# EAGLE design controller_rev4.3_flat (EAGLE 9.6.2)

## Sheet 1 of 3: Controller
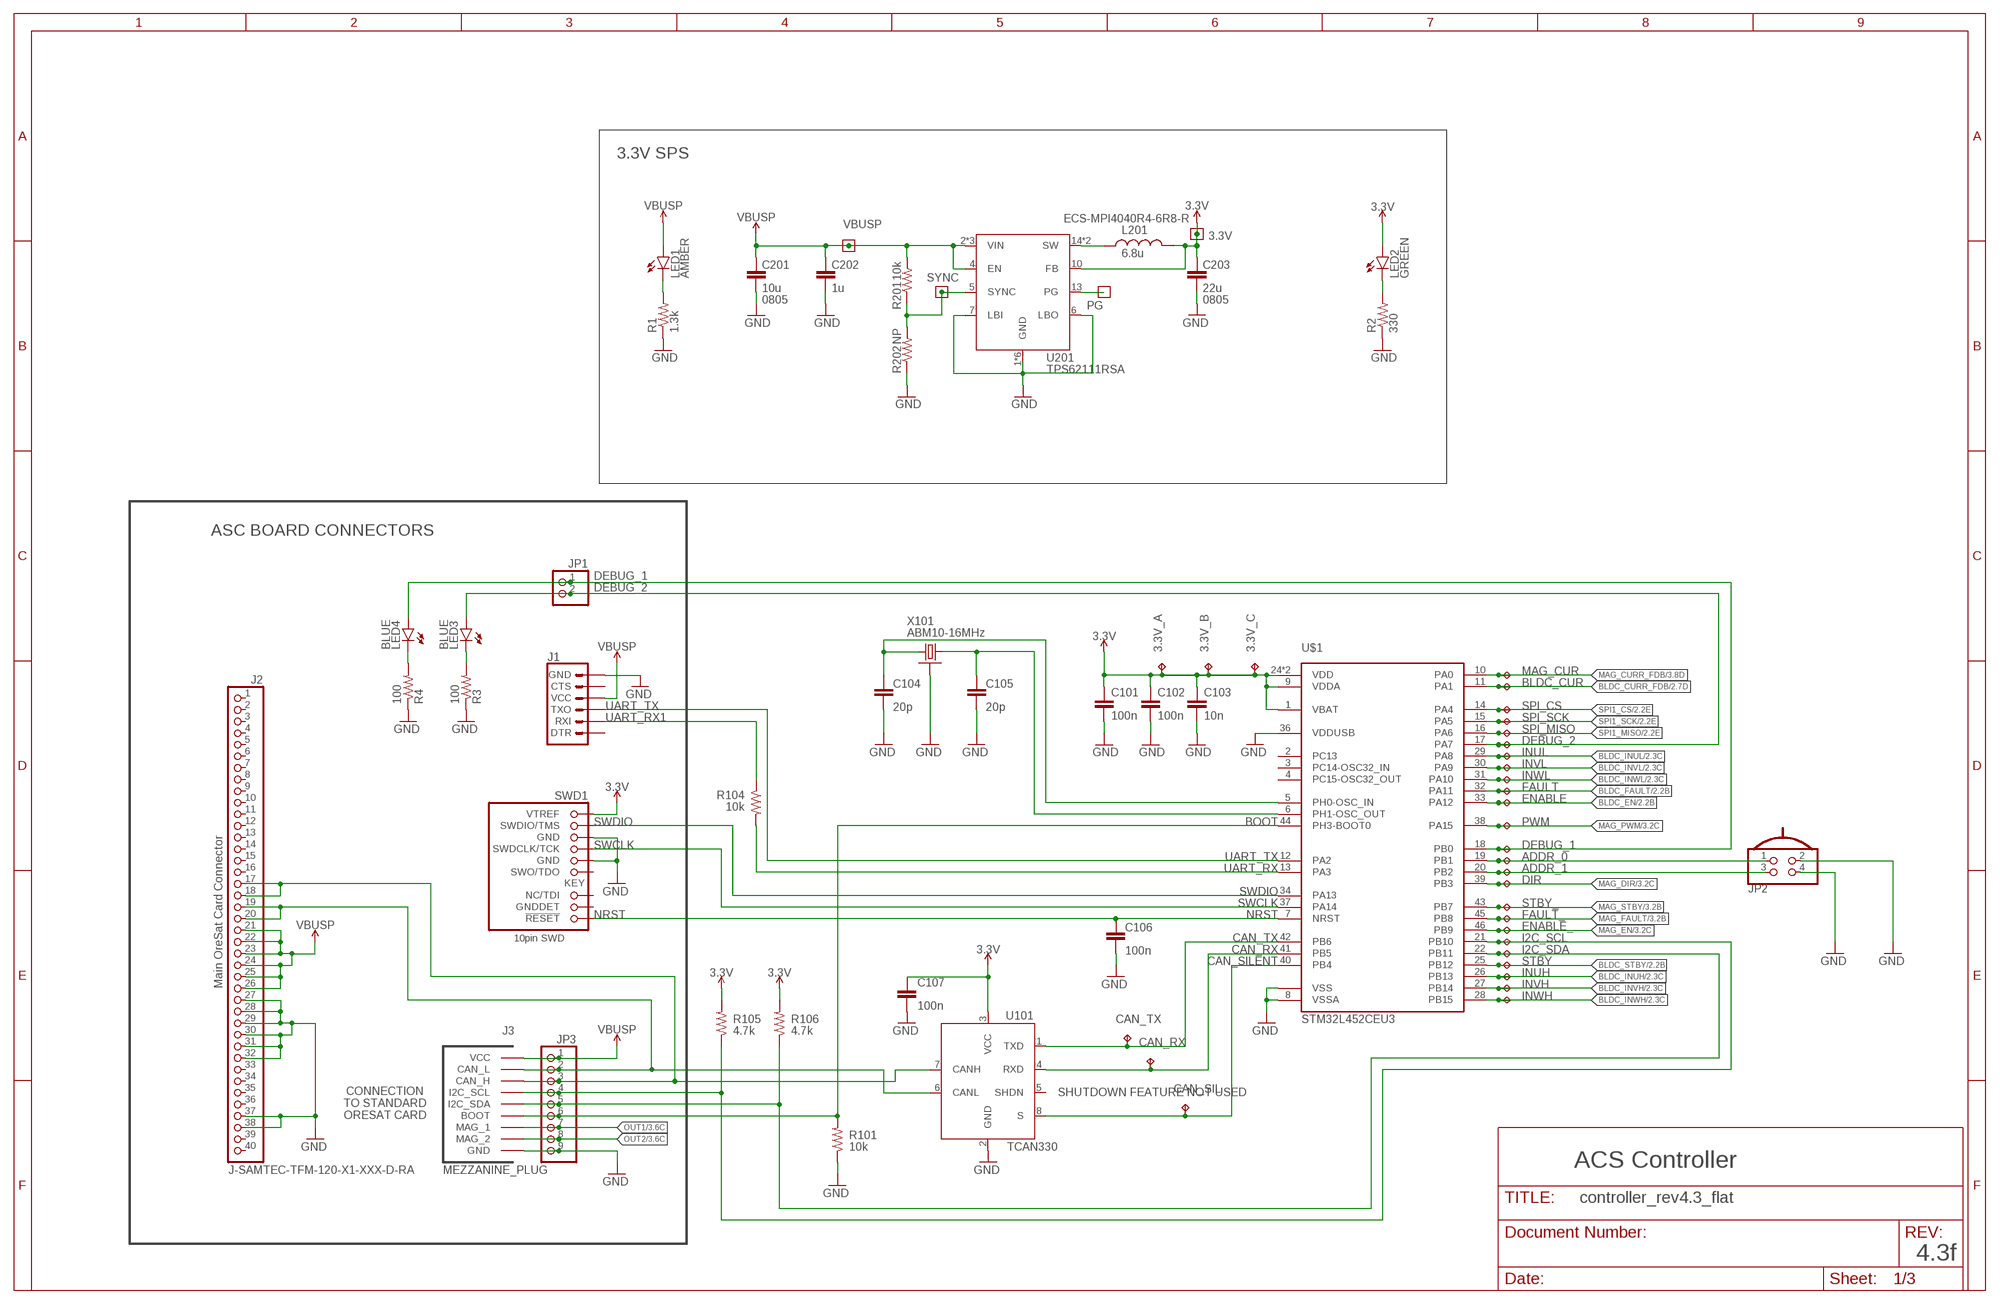
[diagram p0: schematic, sheet 1]

### Parts
3.3V  TEST-POINT-LARGE-SQUARE  [1X01]
3.3V_A  TEST-POINT-LARGE  [1X01]
3.3V_B  TEST-POINT-LARGE  [1X01]
3.3V_C  TEST-POINT-LARGE  [1X01]
ADDR_0  TEST-POINT-LARGE  [1X01]
ADDR_1  TEST-POINT-LARGE  [1X01]
BLDC_CUR  TEST-POINT-LARGE  [1X01]
C101  100n  C-EU0402-B-NOSILK  [.0402-B-NOSILK]
C102  100n  C-EU0402-B-NOSILK  [.0402-B-NOSILK]
C103  10n  C-EU0402-B-NOSILK  [.0402-B-NOSILK]
C104  20p  C-EU0402-B-NOSILK  [.0402-B-NOSILK]
C105  20p  C-EU0402-B-NOSILK  [.0402-B-NOSILK]
C106  100n  C-EU0402-B-NOSILK  [.0402-B-NOSILK]
C107  100n  C-EU0402-B-NOSILK  [.0402-B-NOSILK]
C201  10u  C-EU0805-B-NOSILK  [.0805-B-NOSILK]
C202  1u  C-EU0603-C-NOSILK  [.0603-C-NOSILK]
C203  22u  C-EU0805-B-NOSILK  [.0805-B-NOSILK]
CAN_RX  TEST-POINT-LARGE  [1X01]
CAN_SIL  TEST-POINT-LARGE  [1X01]
CAN_TX  TEST-POINT-LARGE  [1X01]
DEBUG_1  TEST-POINT-LARGE  [1X01]
DEBUG_2  TEST-POINT-LARGE  [1X01]
DIR  TEST-POINT-LARGE  [1X01]
ENABLE  TEST-POINT-LARGE  [1X01]
ENABLE_  TEST-POINT-LARGE  [1X01]
FAULT  TEST-POINT-LARGE  [1X01]
FAULT_  TEST-POINT-LARGE  [1X01]
I2C_SCL  TEST-POINT-LARGE  [1X01]
I2C_SDA  TEST-POINT-LARGE  [1X01]
INUH  TEST-POINT-LARGE  [1X01]
INUL  TEST-POINT-LARGE  [1X01]
INVH  TEST-POINT-LARGE  [1X01]
INVL  TEST-POINT-LARGE  [1X01]
INWH  TEST-POINT-LARGE  [1X01]
INWL  TEST-POINT-LARGE  [1X01]
J1  6_PIN_SERIAL_TARGETSILK  [6_PIN_SERIAL_TARGET_SIDE_W_SILK]
J2  J-SAMTEC-TFM-120-X1-XXX-D-RA  [J-SAMTEC-TFM-120-X1-XXX-D-RA]
J3  MEZZANINE_PLUG  [MEZZANINE_PLUG]
JP1  PINHD-1X2  [1X02]
JP2  PINHD-2X2  [2X02]
JP3  PINHD-1X9  [1X09]
L201  6.8u  L-ECS-MPI4040  [ECS-MPI4040]
LED1  AMBER  LEDCHIPLED_0603  [CHIPLED_0603]
LED2  GREEN  LEDCHIPLED_0603  [CHIPLED_0603]
LED3  BLUE  LEDCHIPLED_0603  [CHIPLED_0603]
LED4  BLUE  LEDCHIPLED_0603  [CHIPLED_0603]
MAG_CUR  TEST-POINT-LARGE  [1X01]
PG  TEST-POINT-LARGE-SQUARE  [1X01]
PWM  TEST-POINT-LARGE  [1X01]
R1  1.3k  R-US_0402-B-NOSILK  [.0402-B-NOSILK]
R2  330  R-US_0402-B-NOSILK  [.0402-B-NOSILK]
R3  100  R-US_0402-B-NOSILK  [.0402-B-NOSILK]
R4  100  R-US_0402-B-NOSILK  [.0402-B-NOSILK]
R101  10k  R-US_0402-B-NOSILK  [.0402-B-NOSILK]
R104  10k  R-US_0402-B-NOSILK  [.0402-B-NOSILK]
R105  4.7k  R-US_0402-B-NOSILK  [.0402-B-NOSILK]
R106  4.7k  R-US_0402-B-NOSILK  [.0402-B-NOSILK]
R201  10k  R-US_0603-C-NOSILK  [.0603-C-NOSILK]
R202  NP  R-US_0603-C-NOSILK  [.0603-C-NOSILK]
SPI_CS  TEST-POINT-LARGE  [1X01]
SPI_MISO  TEST-POINT-LARGE  [1X01]
SPI_SCK  TEST-POINT-LARGE  [1X01]
STBY  TEST-POINT-LARGE  [1X01]
STBY_  TEST-POINT-LARGE  [1X01]
SWD1  1.27MM-SWD-CONNECTOR  [1.27MM_2X5]
SYNC  TEST-POINT-LARGE-SQUARE  [1X01]
U101  TCAN330  [SOT23-8_TI-DCN]
U201  TPS62111RSA  TPS6211X  [S-PVQFN-16]
U$1  STM32L452CEU3  [QFPN-48]
VBUSP  TEST-POINT-LARGE-SQUARE  [1X01]
X101  ABM10-16MHz  CRYSTAL-WITH-GND  [CRYSTAL_2.5X2]

### Nets
3.3V: 3.3V.1 3.3V_A.1(TP) 3.3V_B.1(TP) 3.3V_C.1(TP) C101.1 C102.1 C103.1 C107.1 C203.1 L201.2 LED2.A R105.2 R106.2 SWD1.VTREF U101.3(VCC) U201.10(FB) U$1.1(VBAT) U$1.9(VDDA) U$1.24(VDD) U$1.48(VDD) ; also sheet 2,3
ADDR_0: ADDR_0.1(TP) JP2.1 U$1.19(PB1)
ADDR_1: ADDR_1.1(TP) JP2.3 U$1.20(PB2)
BLDC_CURR_FDB: BLDC_CUR.1(TP) U$1.11(PA1) ; also sheet 2
BLDC_EN: ENABLE.1(TP) U$1.33(PA12) ; also sheet 2
BLDC_FAULT: FAULT.1(TP) U$1.32(PA11) ; also sheet 2
BLDC_INUH: INUH.1(TP) U$1.26(PB13) ; also sheet 2
BLDC_INUL: INUL.1(TP) U$1.29(PA8) ; also sheet 2
BLDC_INVH: INVH.1(TP) U$1.27(PB14) ; also sheet 2
BLDC_INVL: INVL.1(TP) U$1.30(PA9) ; also sheet 2
BLDC_INWH: INWH.1(TP) U$1.28(PB15) ; also sheet 2
BLDC_INWL: INWL.1(TP) U$1.31(PA10) ; also sheet 2
BLDC_STBY: STBY.1(TP) U$1.25(PB12) ; also sheet 2
BOOT: J3.P$9(BOOT) J3.P$22(BOOT) JP3.6 R101.2 U$1.44(PH3-BOOT0)
CAN_H: J2.17 J2.18 J3.P$6(CAN_H) J3.P$25(CAN_H) JP3.3 U101.7(CANH)
CAN_L: J2.19 J2.20 J3.P$5(CAN_L) J3.P$26(CAN_L) JP3.2 U101.6(CANL)
CAN_RX: CAN_RX.1(TP) U101.4(RXD) U$1.41(PB5)
CAN_SILENT: CAN_SIL.1(TP) U101.8(S) U$1.40(PB4)
CAN_TX: CAN_TX.1(TP) U101.1(TXD) U$1.42(PB6)
CLK1: C104.1 U$1.5(PH0-OSC_IN) X101.3
CLK2: C105.1 U$1.6(PH1-OSC_OUT) X101.1
DEBUG_1: DEBUG_1.1(TP) JP1.1 LED4.A U$1.18(PB0)
DEBUG_2: DEBUG_2.1(TP) JP1.2 LED3.A U$1.17(PA7)
GND: C101.2 C102.2 C103.2 C104.2 C105.2 C106.2 C107.2 C201.2 C202.2 C203.2 J1.P$6(GND) J2.27 J2.28 J2.29 J2.30 J2.31 J2.32 J2.37 J2.38 J3.P$1(GND) J3.P$2(GND) J3.P$14(GND) J3.P$15(GND) J3.P$16(GND) J3.P$17(GND) J3.P$29(GND) J3.P$30(GND) JP2.2 JP2.4 JP3.9 R1.1 R2.1 R3.1 R4.1 R101.1 R202.1 SWD1.GND SWD1.GND@2(GND) U101.2(GND) U201.1(GND) U201.6(LBO) U201.7(LBI) U201.9(GND) U201.11(GND) U201.12(GND) U201.16(GND) U201.PAD(GND) U$1.8(VSSA) U$1.23(VSS) U$1.35(VSS) U$1.36(VDDUSB) U$1.47(VSS) U$1.EPAD(VSS) X101.2(SHIELD) X101.4(SHIELD) ; also sheet 2,3
I2C_SCL: I2C_SCL.1(TP) J3.P$7(I2C_SCL) J3.P$24(I2C_SCL) JP3.4 R105.1 U$1.21(PB10)
I2C_SDA: I2C_SDA.1(TP) J3.P$8(I2C_SDA) J3.P$23(I2C_SDA) JP3.5 R106.1 U$1.22(PB11)
MAG_CURR_FDB: MAG_CUR.1(TP) U$1.10(PA0) ; also sheet 3
MAG_DIR: DIR.1(TP) U$1.39(PB3) ; also sheet 3
MAG_EN: ENABLE_.1(TP) U$1.46(PB9) ; also sheet 3
MAG_FAULT: FAULT_.1(TP) U$1.45(PB8) ; also sheet 3
MAG_PWM: PWM.1(TP) U$1.38(PA15) ; also sheet 3
MAG_STBY: STBY_.1(TP) U$1.43(PB7) ; also sheet 3
N$5: LED4.C R4.2
N$6: LED3.C R3.2
N$7: LED1.C R1.2
N$8: LED2.C R2.2
NRST: C106.1 SWD1.!RESET U$1.7(NRST)
OUT1: J3.P$10(MAG_1) J3.P$21(MAG_1) JP3.7 ; also sheet 3
OUT2: J3.P$11(MAG_2) J3.P$20(MAG_2) JP3.8 ; also sheet 3
SPI1_CS: SPI_CS.1(TP) U$1.14(PA4) ; also sheet 2
SPI1_MISO: SPI_MISO.1(TP) U$1.16(PA6) ; also sheet 2
SPI1_SCK: SPI_SCK.1(TP) U$1.15(PA5) ; also sheet 2
SWCLK: SWD1.SWDCLK(SWDCLK/TCK) U$1.37(PA14)
SWDIO: SWD1.SWDIO(SWDIO/TMS) U$1.34(PA13)
TPS62111-PG2: PG.1 U201.13(PG)
TPS62111-SYNC2: R201.1 R202.2 SYNC.1 U201.5(SYNC)
TPS62111_SW1: L201.1 U201.14(SW) U201.15(SW)
UART_RX: R104.2 U$1.13(PA3)
UART_RX1: J1.P$3(RXI) R104.1
UART_TX: J1.P$2(TXO) U$1.12(PA2)
VBUSP: C201.1 C202.1 J1.P$4(VCC) J2.21 J2.22 J2.23 J2.24 J2.25 J2.26 J3.P$3(VCC) J3.P$4(VCC) J3.P$12(VCC) J3.P$13(VCC) J3.P$18(VCC) J3.P$19(VCC) J3.P$27(VCC) J3.P$28(VCC) JP3.1 LED1.A R201.2 U201.2(VIN) U201.3(VIN) U201.4(EN) U201.8(VIN) VBUSP.1 ; also sheet 2,3
Unconnected: J1.P$1(DTR) J1.P$5(CTS) J2.1 J2.2 J2.3 J2.4 J2.5 J2.6 J2.7 J2.8 J2.9 J2.10 J2.11 J2.12 J2.13 J2.14 J2.15 J2.16 J2.33 J2.34 J2.35 J2.36 J2.39 J2.40 SWD1.GNDDET SWD1.NC(NC/TDI) SWD1.SWO(SWO/TDO) U101.5(SHDN) U$1.2(PC13) U$1.3(PC14-OSC32_IN) U$1.4(PC15-OSC32_OUT)

### Notes on the sheet
- 3.3V SPS
- ECS-MPI4040R4-6R8-R
- 0805 | 0805
- ASC BOARD CONNECTORS
- Main OreSat Card Connector
- CONNECTION 
  TO STANDARD
  ORESAT CARD
- SHUTDOWN FEATURE NOT USED
- ACS Controller
- 4.3f

## Sheet 2 of 3: Reaction Wheel
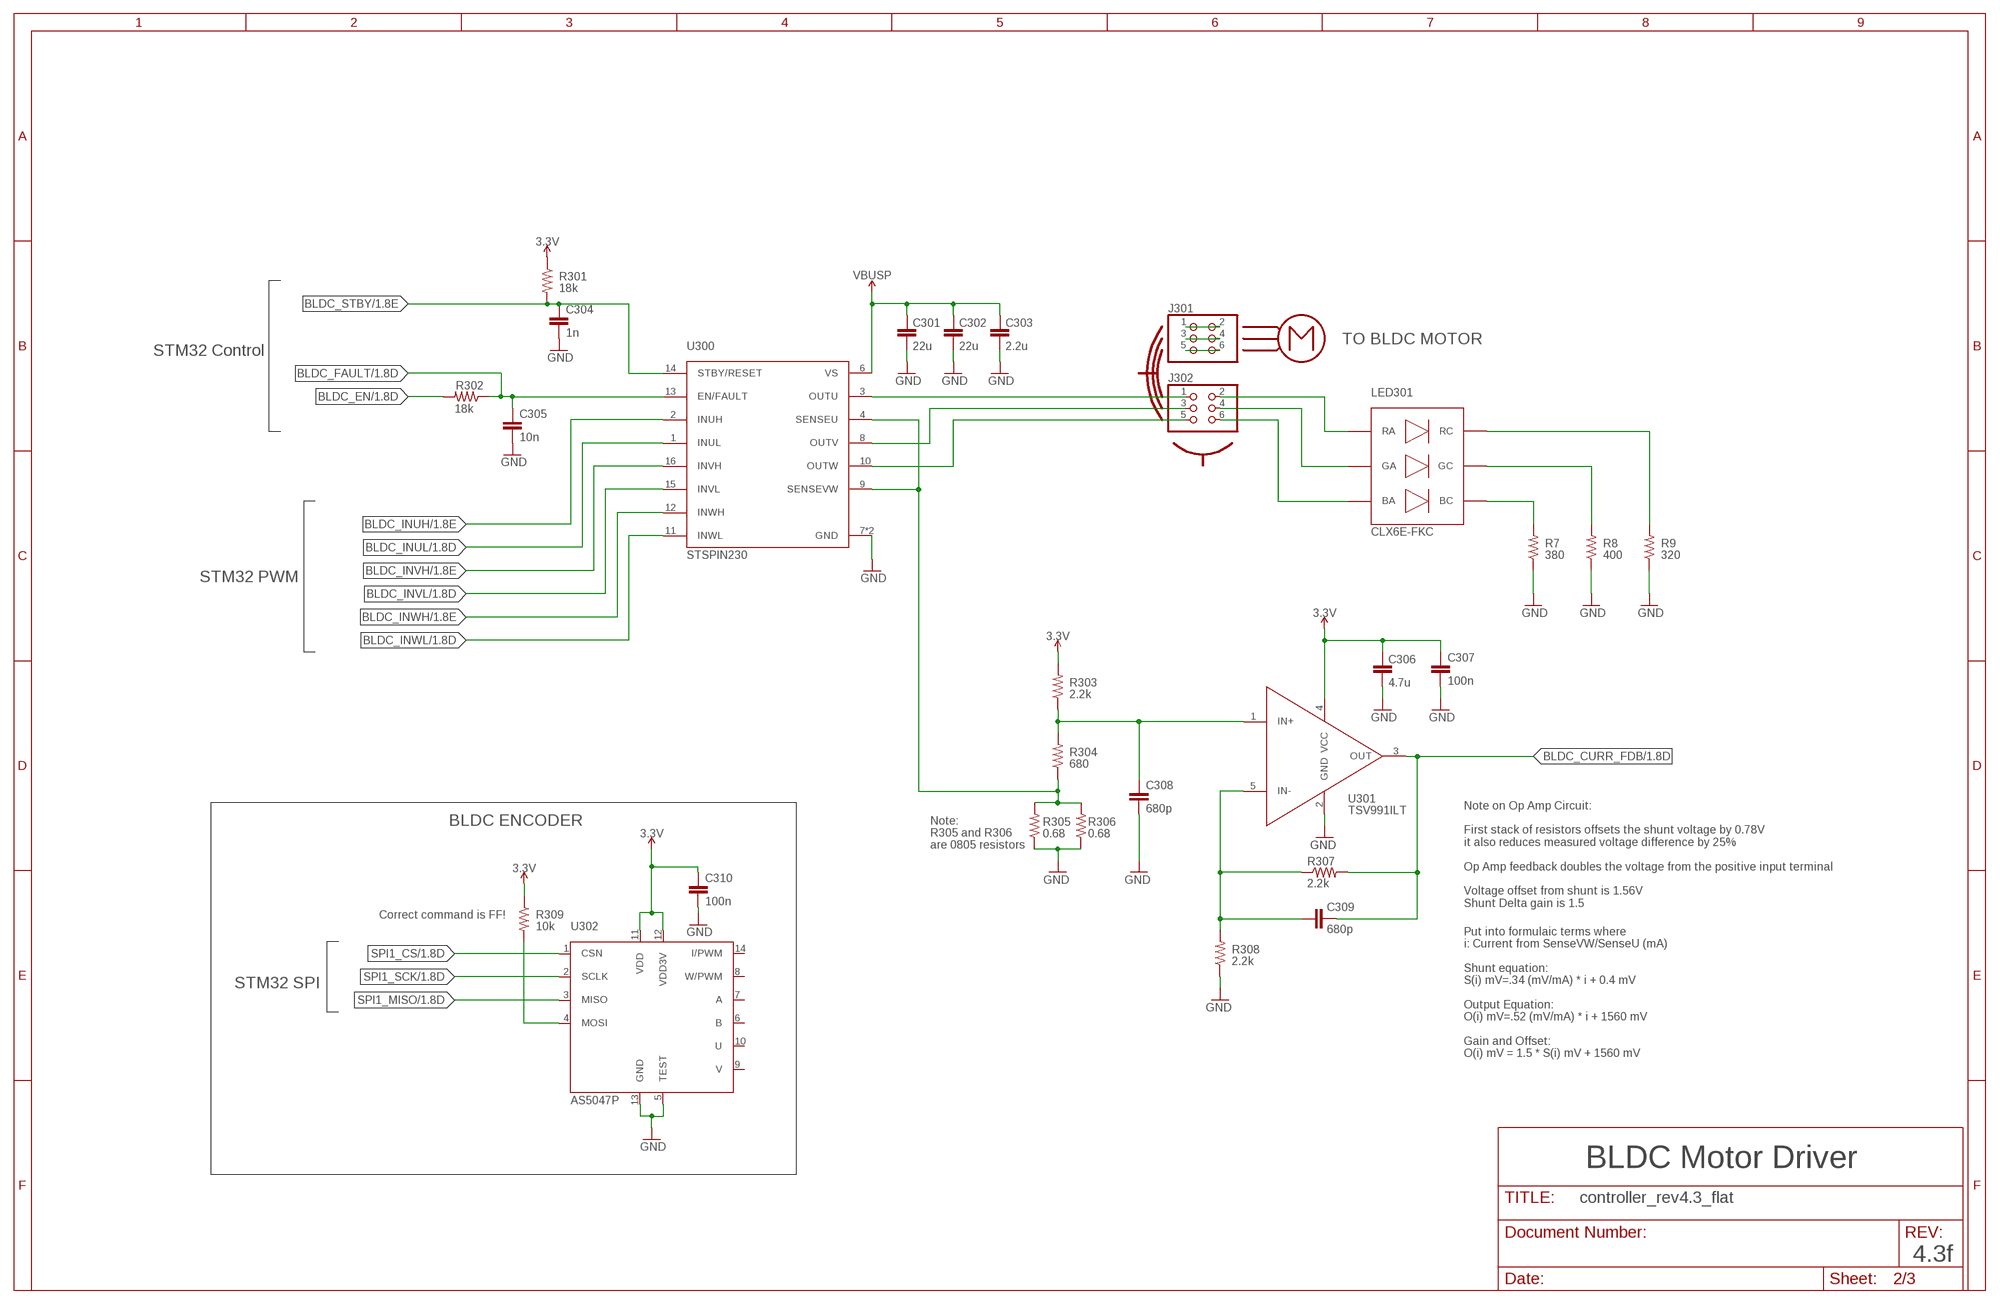
[diagram p1: schematic, sheet 2]

### Parts
C301  22u  C-EU0603-B-NOSILK  [.0603-B-NOSILK]
C302  22u  C-EU0603-B-NOSILK  [.0603-B-NOSILK]
C303  2.2u  C-EU0603-B-NOSILK  [.0603-B-NOSILK]
C304  1n  C-EU0402-B-NOSILK  [.0402-B-NOSILK]
C305  10n  C-EU0402-B-NOSILK  [.0402-B-NOSILK]
C306  4.7u  C-EU0603-B-NOSILK  [.0603-B-NOSILK]
C307  100n  C-EU0402-B-NOSILK  [.0402-B-NOSILK]
C308  680p  C-EU0402-B-NOSILK  [.0402-B-NOSILK]
C309  680p  C-EU0402-B-NOSILK  [.0402-B-NOSILK]
C310  100n  C-EU0402-B-NOSILK  [.0402-B-NOSILK]
J301  PINHD-2X3  [2X03]
J302  PINHD-2X3  [2X03]
LED301  CLX6E-FKC  [CLX6E-FKC]
R7  380  R-US_0402-B-NOSILK  [.0402-B-NOSILK]
R8  400  R-US_0402-B-NOSILK  [.0402-B-NOSILK]
R9  320  R-US_0402-B-NOSILK  [.0402-B-NOSILK]
R301  18k  R-US_0402-B-NOSILK  [.0402-B-NOSILK]
R302  18k  R-US_0402-B-NOSILK  [.0402-B-NOSILK]
R303  2.2k  R-US_0402-B-NOSILK  [.0402-B-NOSILK]
R304  680  R-US_0402-B-NOSILK  [.0402-B-NOSILK]
R305  0.68  R-US_0805-B-NOSILK  [.0805-B-NOSILK]
R306  0.68  R-US_0805-B-NOSILK  [.0805-B-NOSILK]
R307  2.2k  R-US_0402-B-NOSILK  [.0402-B-NOSILK]
R308  2.2k  R-US_0402-B-NOSILK  [.0402-B-NOSILK]
R309  10k  R-US_0402-B-NOSILK  [.0402-B-NOSILK]
U300  STSPIN230  [VFQPN]
U301  TSV991ILT  [SOT23-5]
U302  AS5047P  [TSSOP14]

### Nets
3.3V: C306.1 C307.1 C310.1 R301.1 R303.2 R309.1 U301.4(VCC) U302.11(VDD) U302.12(VDD3V) ; also sheet 1,3
AS5047_MOSI: R309.2 U302.4(MOSI)
B_IN+: C308.1 R303.1 R304.2 U301.1(IN+)
B_IN-: C309.2 R307.1 R308.2 U301.5(IN-)
BLDC_CURR_FDB: C309.1 R307.2 U301.3(OUT) ; also sheet 1
BLDC_EN: R302.2 ; also sheet 1
BLDC_FAULT: C305.1 R302.1 U300.13(EN/FAULT) ; also sheet 1
BLDC_INUH: U300.2(INUH) ; also sheet 1
BLDC_INUL: U300.1(INUL) ; also sheet 1
BLDC_INVH: U300.16(INVH) ; also sheet 1
BLDC_INVL: U300.15(INVL) ; also sheet 1
BLDC_INWH: U300.12(INWH) ; also sheet 1
BLDC_INWL: U300.11(INWL) ; also sheet 1
BLDC_STBY: C304.1 R301.2 U300.14(STBY/RESET) ; also sheet 1
GND: C301.2 C302.2 C303.2 C304.2 C305.2 C306.2 C307.2 C308.2 C310.2 R7.1 R8.1 R9.1 R305.1 R306.1 R308.1 U300.7(GND) U300.EPAD(GND) U301.2(GND) U302.5(TEST) U302.13(GND) ; also sheet 1,3
N$1: J302.2 LED301.P$4(RA)
N$2: J302.4 LED301.P$5(GA)
N$3: J302.6 LED301.P$6(BA)
N$4: J301.5 J301.6
N$9: J301.3 J301.4
N$10: J301.1 J301.2
N$14: LED301.P$1(BC) R7.2
N$15: LED301.P$2(GC) R8.2
N$16: LED301.P$3(RC) R9.2
SENSE_BLDC: R304.1 R305.2 R306.2 U300.4(SENSEU) U300.9(SENSEVW)
SPI1_CS: U302.1(CSN) ; also sheet 1
SPI1_MISO: U302.3(MISO) ; also sheet 1
SPI1_SCK: U302.2(SCLK) ; also sheet 1
U: J302.1 U300.3(OUTU)
V: J302.3 U300.8(OUTV)
VBUSP: C301.1 C302.1 C303.1 U300.6(VS) ; also sheet 1,3
W: J302.5 U300.10(OUTW)
Unconnected: U302.6(B) U302.7(A) U302.8(W/PWM) U302.9(V) U302.10(U) U302.14(I/PWM)

### Notes on the sheet
- TO BLDC MOTOR
- STM32 Control
- STM32 PWM
- BLDC ENCODER
- Note:
  R305 and R306
  are 0805 resistors
- Note on Op Amp Circuit:
  
  First stack of resistors offsets the shunt voltage by 0.78V
  it also reduces measured voltage difference by 25%
  
  Op Amp feedback doubles the voltage from the positive input terminal
  
  Voltage offset from shunt is 1.56V
  Shunt Delta gain is 1.5
- Correct command is FF!
- STM32 SPI
- Put into formulaic terms where
  i: Current from SenseVW/SenseU (mA)
  
  Shunt equation:
  S(i) mV=.34 (mV/mA) * i + 0.4 mV
  
  Output Equation:
  O(i) mV=.52 (mV/mA) * i + 1560 mV
  
  Gain and Offset:
  O(i) mV = 1.5 * S(i) mV + 1560 mV
- BLDC Motor Driver
- 4.3f

## Sheet 3 of 3: Magnetorquer
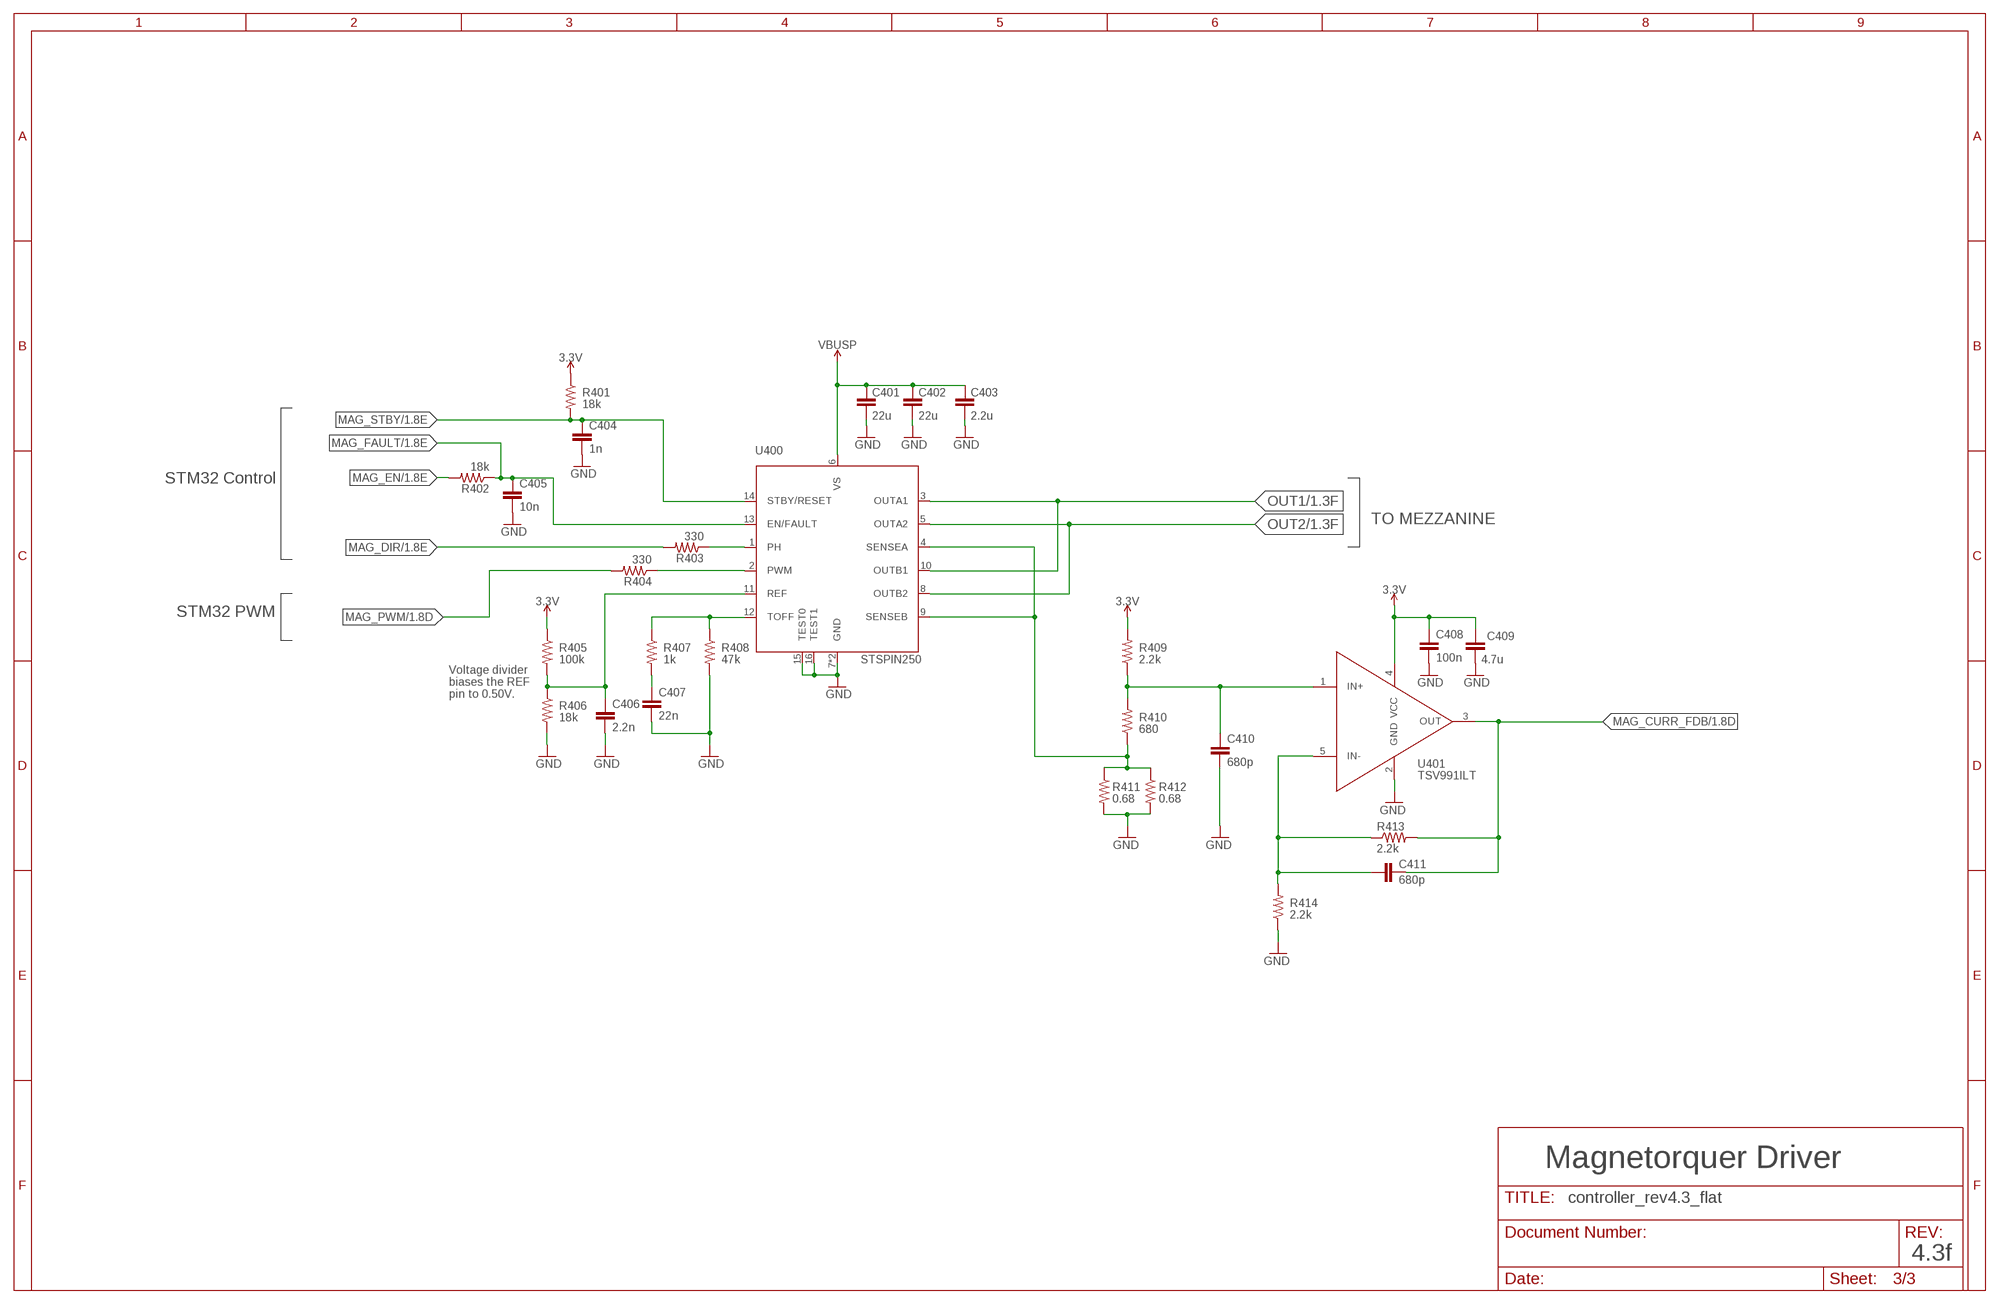
[diagram p2: schematic, sheet 3]

### Parts
C401  22u  C-EU0603-B-NOSILK  [.0603-B-NOSILK]
C402  22u  C-EU0603-B-NOSILK  [.0603-B-NOSILK]
C403  2.2u  C-EU0603-B-NOSILK  [.0603-B-NOSILK]
C404  1n  C-EU0402-B-NOSILK  [.0402-B-NOSILK]
C405  10n  C-EU0402-B-NOSILK  [.0402-B-NOSILK]
C406  2.2n  C-EU0402-B-NOSILK  [.0402-B-NOSILK]
C407  22n  C-EU0402-B-NOSILK  [.0402-B-NOSILK]
C408  100n  C-EU0402-B-NOSILK  [.0402-B-NOSILK]
C409  4.7u  C-EU0603-B-NOSILK  [.0603-B-NOSILK]
C410  680p  C-EU0402-B-NOSILK  [.0402-B-NOSILK]
C411  680p  C-EU0402-B-NOSILK  [.0402-B-NOSILK]
R401  18k  R-US_0402-B-NOSILK  [.0402-B-NOSILK]
R402  18k  R-US_0402-B-NOSILK  [.0402-B-NOSILK]
R403  330  R-US_0402-B-NOSILK  [.0402-B-NOSILK]
R404  330  R-US_0402-B-NOSILK  [.0402-B-NOSILK]
R405  100k  R-US_0402-B-NOSILK  [.0402-B-NOSILK]
R406  18k  R-US_0402-B-NOSILK  [.0402-B-NOSILK]
R407  1k  R-US_0402-B-NOSILK  [.0402-B-NOSILK]
R408  47k  R-US_0402-B-NOSILK  [.0402-B-NOSILK]
R409  2.2k  R-US_0402-B-NOSILK  [.0402-B-NOSILK]
R410  680  R-US_0402-B-NOSILK  [.0402-B-NOSILK]
R411  0.68  R-US_0805-B-NOSILK  [.0805-B-NOSILK]
R412  0.68  R-US_0805-B-NOSILK  [.0805-B-NOSILK]
R413  2.2k  R-US_0402-B-NOSILK  [.0402-B-NOSILK]
R414  2.2k  R-US_0402-B-NOSILK  [.0402-B-NOSILK]
U400  STSPIN250  [VFQPN]
U401  TSV991ILT  [SOT23-5]

### Nets
3.3V: C408.1 C409.1 R401.1 R405.1 R409.2 U401.4(VCC) ; also sheet 1,2
250_REF: C406.1 R405.2 R406.1 U400.11(REF)
250_TOFF: R407.1 R408.1 U400.12(TOFF)
GND: C401.2 C402.2 C403.2 C404.2 C405.2 C406.2 C407.2 C408.2 C409.2 C410.2 R406.2 R408.2 R411.2 R412.2 R414.1 U400.7(GND) U400.15(TEST0) U400.16(TEST1) U400.EPAD(GND) U401.2(GND) ; also sheet 1,2
M_IN+: C410.1 R409.1 R410.2 U401.1(IN+)
M_IN-: C411.2 R413.1 R414.2 U401.5(IN-)
M_PH: R403.1 U400.1(PH)
M_PWM: R404.1 U400.2(PWM)
MAG_CURR_FDB: C411.1 R413.2 U401.3(OUT) ; also sheet 1
MAG_DIR: R403.2 ; also sheet 1
MAG_EN: R402.2 ; also sheet 1
MAG_FAULT: C405.1 R402.1 U400.13(EN/FAULT) ; also sheet 1
MAG_PWM: R404.2 ; also sheet 1
MAG_STBY: C404.1 R401.2 U400.14(STBY/RESET) ; also sheet 1
OUT1: U400.3(OUTA1) U400.10(OUTB1) ; also sheet 1
OUT2: U400.5(OUTA2) U400.8(OUTB2) ; also sheet 1
SENSE_MAG: R410.1 R411.1 R412.1 U400.4(SENSEA) U400.9(SENSEB)
TOFF1: C407.1 R407.2
VBUSP: C401.1 C402.1 C403.1 U400.6(VS) ; also sheet 1,2

### Notes on the sheet
- STM32 Control
- TO MEZZANINE
- STM32 PWM
- Voltage divider
  biases the REF
  pin to 0.50V.
- Magnetorquer Driver
- 4.3f

## Library data of the parts
3.3V PG SYNC VBUSP = oresat-misc:TEST-POINT-LARGE-SQUARE
3.3V_A 3.3V_B 3.3V_C ADDR_0 ADDR_1 BLDC_CUR CAN_RX CAN_SIL CAN_TX DEBUG_1 DEBUG_2 DIR ENABLE ENABLE_ FAULT FAULT_ I2C_SCL I2C_SDA INUH INUL INVH INVL INWH INWL MAG_CUR PWM SPI_CS SPI_MISO SPI_SCK STBY STBY_ = oresat-misc:TEST-POINT-LARGE; BOM: EXCLUDE
C101-C103 C107 C304 C305 C307-C310 C404-C408 C410 C411 = rcl_custom:C-EU: CAPACITOR, European symbol; DIS: Digi-Key; DPN: 1276-1001-1-ND; MFR: Samsung; MPN: CL05B104KO5NNNC
C104-C106 = rcl_custom:C-EU: CAPACITOR, European symbol; DIS: Digi-Key; DPN: 1276-6601-1-ND; MFR: Samsung; MPN: CL05C200JB51PNC
C201 = oresat-rcl:C-EU: CAPACITOR, European symbol; DIS: Digi-Key; DPN: 1276-6472-1-ND; MFR: Samsung; MPN: CL21B106KOQNNNG
C202 = oresat-rcl:C-EU: CAPACITOR, European symbol; DIS: Digi-Key; DPN: 311-1444-1-ND; MFR: Yageo; MPN: CC0603KRX5R7BB105
C203 = oresat-rcl:C-EU: CAPACITOR, European symbol; DIS: Digi-Key; DPN: 490-9959-1-ND; MFR: Murata; MPN: GRM21BD71A226ME44L
C301-C303 C306 C401-C403 C409 = oresat-rcl:C-EU: CAPACITOR, European symbol; DIS: Digi-Key; DPN: 1276-1001-1-ND; MFR: Samsung; MPN: CL05B104KO5NNNC
J1 = SparkFun-Connectors:6_PIN_SERIAL_TARGET: 6-pin header connection for use with the "FTDI BASIC" pinout - TARGET SIDE. Also known as "Arduino Serial Program Header". It is used to mate with our FTDI Basic serial programmers using the Arduino IDE. Note, this device has "TARGET" in the name. It is intended to be used on a design that contains a target micro-controller that you wish to program. The "sister" device, named "CABLE" is inteneded to be used on a design that usually lives on the end of your USB cable and prvides the converter chip (FTDI232 or FTDI231x) to commnicate serial RX/TX. You can populate with some of these: Break Away Headers - Straight <https://www.sparkfun.com/products/116> (PRT-00116) For reference (or to suit your programming needs) check out these designs: SparkFun FTDI Basic Breakout - 5V <https://www.sparkfun.com/products/9716> (DEV-09716) SparkFun FTDI Basic Breakout - 3.3V <https://www.sparkfun.com/products/9873> (DEV-09873) SparkFun FTDI SmartBasic <https://www.sparkfun.com/products/12935> (DEV-12935) SparkFun Beefy 3 - FTDI Basic Breakout <https://www.sparkfun.com/products/13746> (DEV-13746)
J2 = J-Samtec-TFM-120-X1-XXX-D-RA:J-SAMTEC-TFM-120-X1-XXX-D-RA; DESCRIPTION: 90 degree 40 pos conn header; DIST: Digi-Key; DIST_PN: SAM10145-ND; GENERIC: N; MFG: Samtec Inc.; MFG_PN: TFM-120-01-L-D-RA; P-NP: P
J3 = J-Molex-05xxxx030x-30pin-mezzanine-connector-M+F:MEZZANINE_PLUG: 30 pin board to board connector Locking mezzanine connector Datasheet <https://www.molex.com/pdm_docs/sd/555600307_sd.pdf>; DESCRIPTION: 30 pos board to board connector; DIST: Digi-Key; DIST_PN: WM9218CT-ND; GENERIC: N; MFG: Molex; MFG_PN: 0555600307; P-NP: P
J301 J302 = pinhead:PINHD-2X3: PIN HEADER
JP1 = pinhead:PINHD-1X2: PIN HEADER
JP2 = pinhead:PINHD-2X2: PIN HEADER; DESCRIPTION: 2x2 .1 inch pin header; DIST: Digi-Key; DIST_PN: 952-1772-ND; GENERIC: Y; MFG: Harwin Inc.; MFG_PN: M20-9760246; P-NP: P
JP3 = pinhead:PINHD-1X9: PIN HEADER
L201 = L-ECS-MPI4040:L-ECS-MPI4040; DIS: Digi-Key; DPN: XC2337CT-ND; MFR: ECS; MPN: ECS-MPI4040R4-6R8-R
LED1-LED4 = led:LED: LED OSRAM: - CHIPLED LG R971, LG N971, LY N971, LG Q971, LY Q971, LO R971, LY R971 LH N974, LH R974 LS Q976, LO Q976, LY Q976 LO Q996 - Hyper CHIPLED LW Q18S LB Q993, LB Q99A, LB R99A - SideLED LS A670, LO A670, LY A670, LG A670, LP A670 LB A673, LV A673, LT A673, LW A673 LH A674 LY A675 LS A676, LA A676, LO A676, LY A676, LW A676 LS A679, LY A679, LG A679 - Hyper Micro SIDELED® LS Y876, LA Y876, LO Y876, LY Y876 LT Y87S - SmartLED LW L88C, LW L88S LB L89C, LB L89S, LG L890 LS L89K, LO L89K, LY L89K LS L896, LA L896, LO L896, LY L896 - TOPLED LS T670, LO T670, LY T670, LG T670, LP T670 LSG T670, LSP T670, LSY T670, LOP T670, LYG T670 LG T671, LOG T671, LSG T671 LB T673, LV T673, LT T673, LW T673 LH T674 LS T676, LA T676, LO T676, LY T676, LB T676, LH T676, LSB T676, LW T676 LB T67C, LV T67C, LT T67C, LS T67K, LO T67K, LY T67K, LW E67C LS E67B, LA E67B, LO E67B, LY E67B, LB E67C, LV E67C, LT E67C LW T67C LS T679, LY T679, LG T679 LS T770, LO T770, LY T770, LG T770, LP T770 LB T773, LV T773, LT T773, LW T773 LH T774 LS E675, LA E675, LY E675, LS T675 LS T776, LA T776, LO T776, LY T776, LB T776 LHGB T686 LT T68C, LB T68C - Hyper Mini TOPLED® LB M676 - Mini TOPLED Santana® LG M470 LS M47K, LO M47K, LY M47K Source: http://www.osram.convergy.de LUXEON: - LUMILED® LXK2-PW12-R00, LXK2-PW12-S00, LXK2-PW14-U00, LXK2-PW14-V00 LXK2-PM12-R00, LXK2-PM12-S00, LXK2-PM14-U00 LXK2-PE12-Q00, LXK2-PE12-R00, LXK2-PE12-S00, LXK2-PE14-T00, LXK2-PE14-U00 LXK2-PB12-K00, LXK2-PB12-L00, LXK2-PB12-M00, LXK2-PB14-N00, LXK2-PB14-P00, LXK2-PB14-Q00 LXK2-PR12-L00, LXK2-PR12-M00, LXK2-PR14-Q00, LXK2-PR14-R00 LXK2-PD12-Q00, LXK2-PD12-R00, LXK2-PD12-S00 LXK2-PH12-R00, LXK2-PH12-S00 LXK2-PL12-P00, LXK2-PL12-Q00, LXK2-PL12-R00 Source: www.luxeon.com KINGBRIGHT: KA-3528ASYC Source: www.kingbright.com
LED301 = D-Cree-CLX6E-RGB-LED:CLX6E-FKC: digikey part number: CLX6E-FKC-CH1M1D1BB7C3D3CT-ND
R1-R4 R305 R306 R411 R412 = oresat-rcl:R-US_: RESISTOR, American symbol
R7-R9 R101 R104-R106 R301-R304 R307-R309 R401-R410 R413 R414 = rcl_custom:R-US_: RESISTOR, American symbol; DIS: Digi-Key; DPN: 1276-4275-1-ND; MFR: Samsung; MPN: RC1005F6653CS
R201 = oresat-rcl:R-US_: RESISTOR, American symbol; DIS: Digi-Key; DPN: RNCP0603FTD10K0CT-ND; MFR: Stackpole; MPN: RNCP0603FTD10K0
R202 = oresat-rcl:R-US_: RESISTOR, American symbol; DIS: Digi-Key; DPN: 1276-4275-1-ND; MFR: Samsung; MPN: RC1005F6653CS
SWD1 = J-CNC-3220-10-0100-00-ARM-SWD-port:1.27MM-SWD-CONNECTOR: ARM SWD Programming Header. Example part is the CNC 3220-10-0100-00
U101 = TCAN330:TCAN330; DIS: Digi-Key; DPN: 296-44211-1-ND; MFR: Texas Instruments; MPN: TCAN330GDCNT
U201 = U-TI-TPS6211x-SPS-buck:TPS6211X: TPS6211x 17-V, 1.5-A, Synchronous Step-Down Converter; DIS: Digi-Key; DPN: 296-37681-2-ND; MFR: Texas Instruments; MPN: TPS62111RSA
U300 = U-ST-STSPIN2x0-motor-drivers:STSPIN230: Brushless DC motor driver STSPIN230 Low voltage tripple half bridge Datasheet <https://www.st.com/content/ccc/resource/technical/document/datasheet/group3/f5/79/9b/db/49/dd/4d/36/DM00293530/files/DM00293530.pdf/jcr:content/translations/en.DM00293530.pdf>; DESCRIPTION: Tripple half bridge motor driver; DIST: Digi-Key; DIST_PN: 497-16603-1-ND; GENERIC: N; MFG: STMicroelectronics; MFG_PN: STSPIN230; P-NP: P
U301 U401 = U-ST-TSV991ILT-op-amp:TSV991ILT: Rail to Rail low power op amp TSV991ILT 1.5mV offset voltage Operation range of 2.5 to 5.5 Volts Datasheet <https://www.st.com/content/ccc/resource/technical/document/datasheet/d8/e3/a5/aa/8f/d7/42/67/CD00144611.pdf/files/CD00144611.pdf/jcr:content/translations/en.CD00144611.pdf>; DESCRIPTION: Low voltage rail to rail op amp; DIST: Digi-Key; DIST_PN: 497-6001-1-ND; GENERIC: Y; MFG: STMicroelectronics; MFG_PN: TSV991ILT; P-NP: P
U302 = U-AMS-AS5047P-ATSM-BLDC-encoder:AS5047P: Programable rotary encoder, 14 bit percision AS5047P-ATSM SPI output 14 bit percision-12 bit decimal simulated UVW coil output ABi quadrature output 28 Krpm maximum tracking speed Datasheet <https://ams.com/documents/20143/36005/AS5047P_DS000324_2-00.pdf>; DESCRIPTION: Brushless motor controller; DIST: Digi-Key; DIST_PN: AS5047P-ATSMCT-ND; GENERIC: N; MFG: ams; MFG_PN: AS5047P-ATSM; P-NP: P
U400 = U-ST-STSPIN2x0-motor-drivers:STSPIN250: Brushed motor driver STSPIN250 Full H bridge Datasheet <https://www.st.com/content/ccc/resource/technical/document/datasheet/group3/c0/0a/9b/75/f1/48/4f/2b/DM00335775/files/DM00335775.pdf/jcr:content/translations/en.DM00335775.pdf>; DESCRIPTION: Full H-Bridge brushed motor driver; DIST: Digi-Key; DIST_PN: 497-17035-1-ND; GENERIC: N; MFG: STMicroelectronics; MFG_PN: STSPIN250; P-NP: P
U$1 = U-ST-STML453CEU3-uC:STM32L452CEU3: Low power micro controller STM32L452CEU3 32 bit memory 512kB Flash 80MHz Datasheet <https://www.st.com/content/ccc/resource/technical/document/datasheet/group3/fc/c2/8d/b7/99/d8/42/9e/DM00340549/files/DM00340549.pdf/jcr:content/translations/en.DM00340549.pdf>; DISCRIPTION: 32 bit Microcontroller; DIST: Digi-Key; DIST_PN: 497-18598-ND; GENERIC: N; MFG: STMicroelectronics; MFG_PN: STM32L452CEU3; P-NP: P
X101 = low-gain-radio:CRYSTAL-WITH-GND; DIS: Digi-Key; DPN: XC2181CT-ND; MFR: ECS Inc.; MPN: ECS-160-10-36Q-ES-TR

## Board
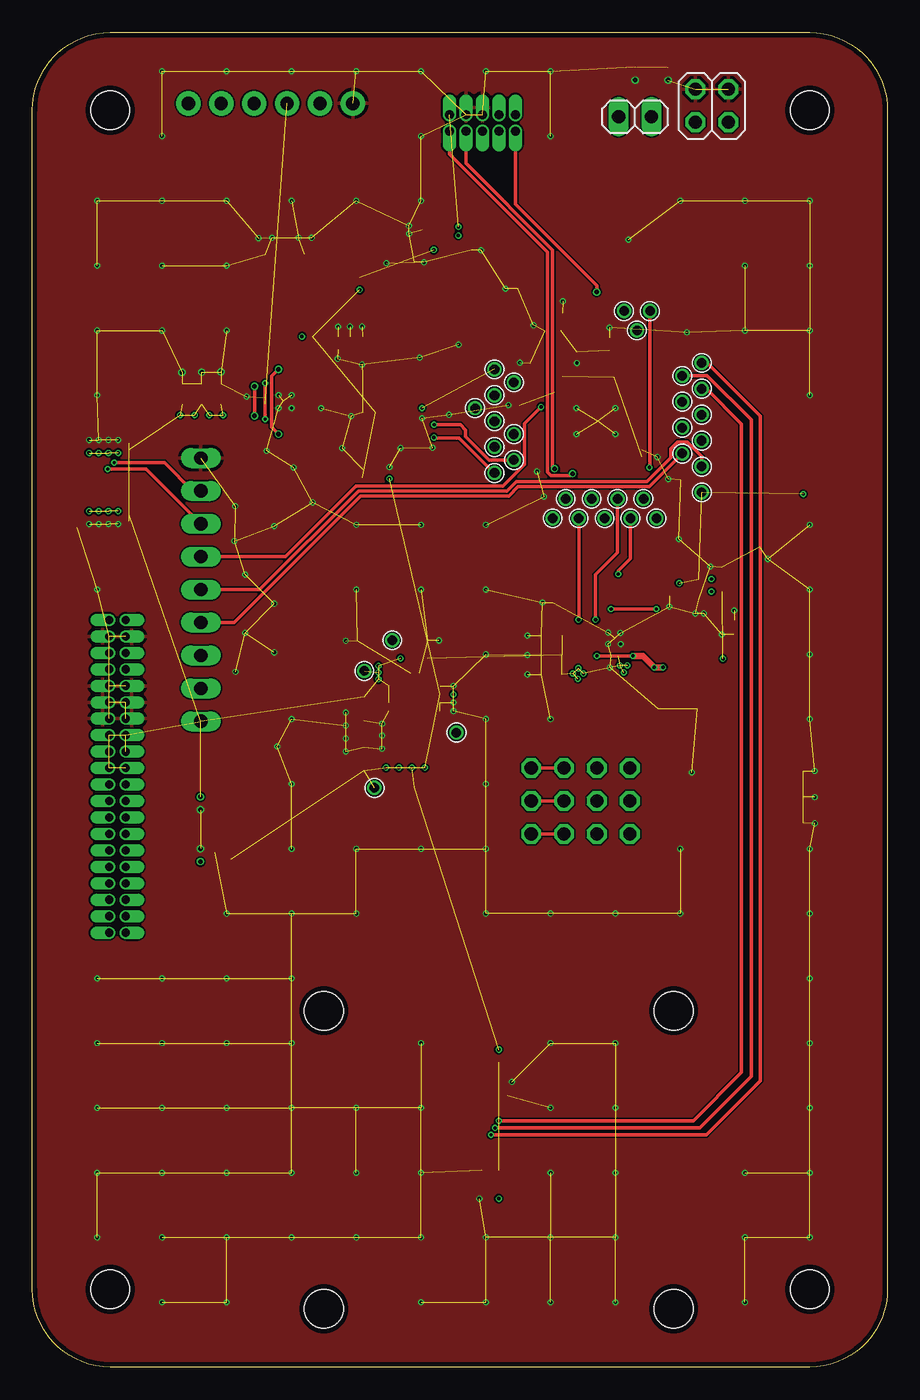
[diagram p3: board, top side]
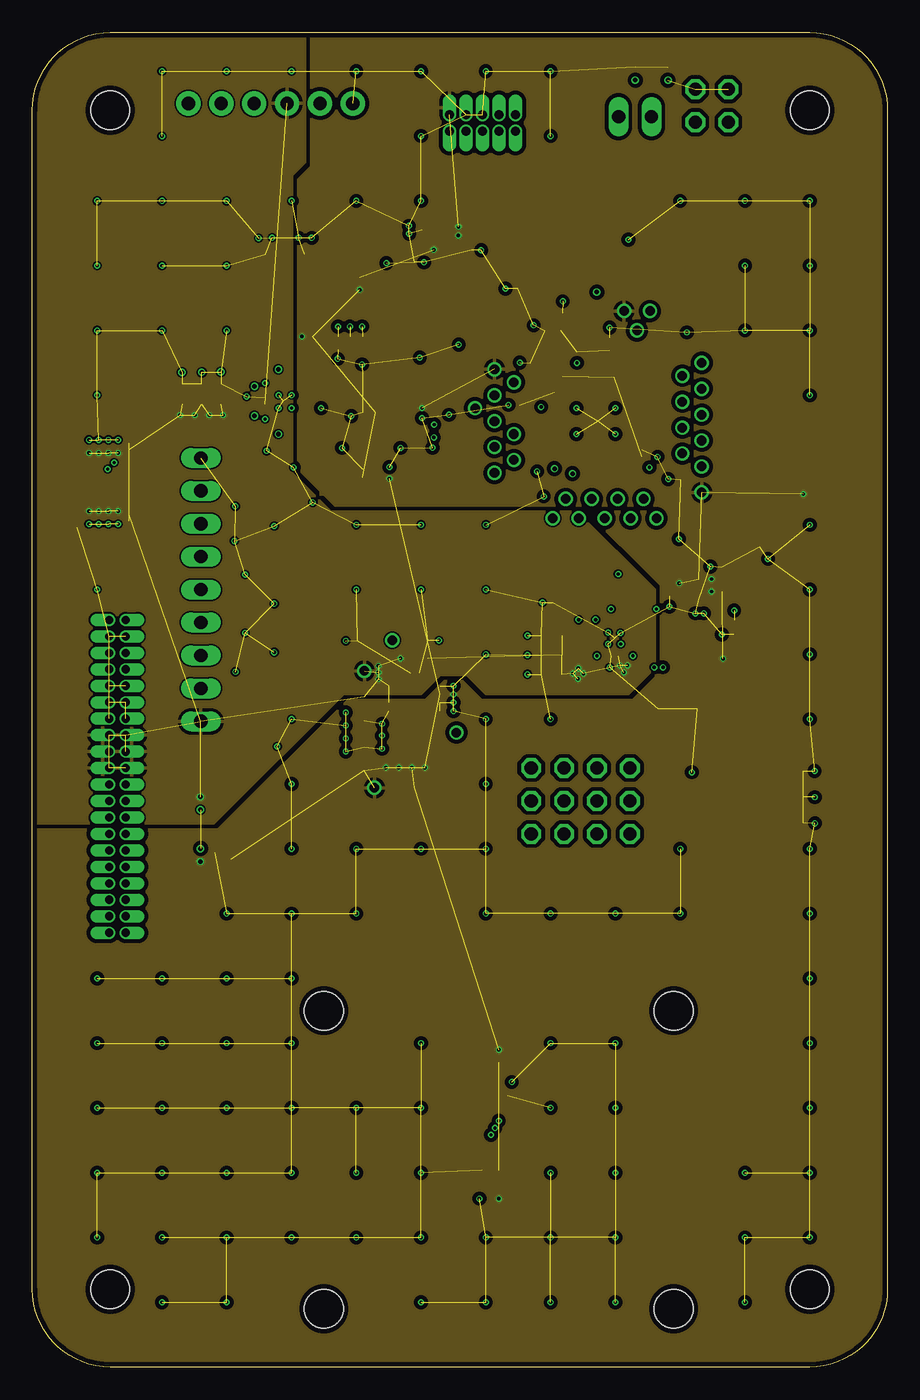
[diagram p4: board, inner layer Route2]
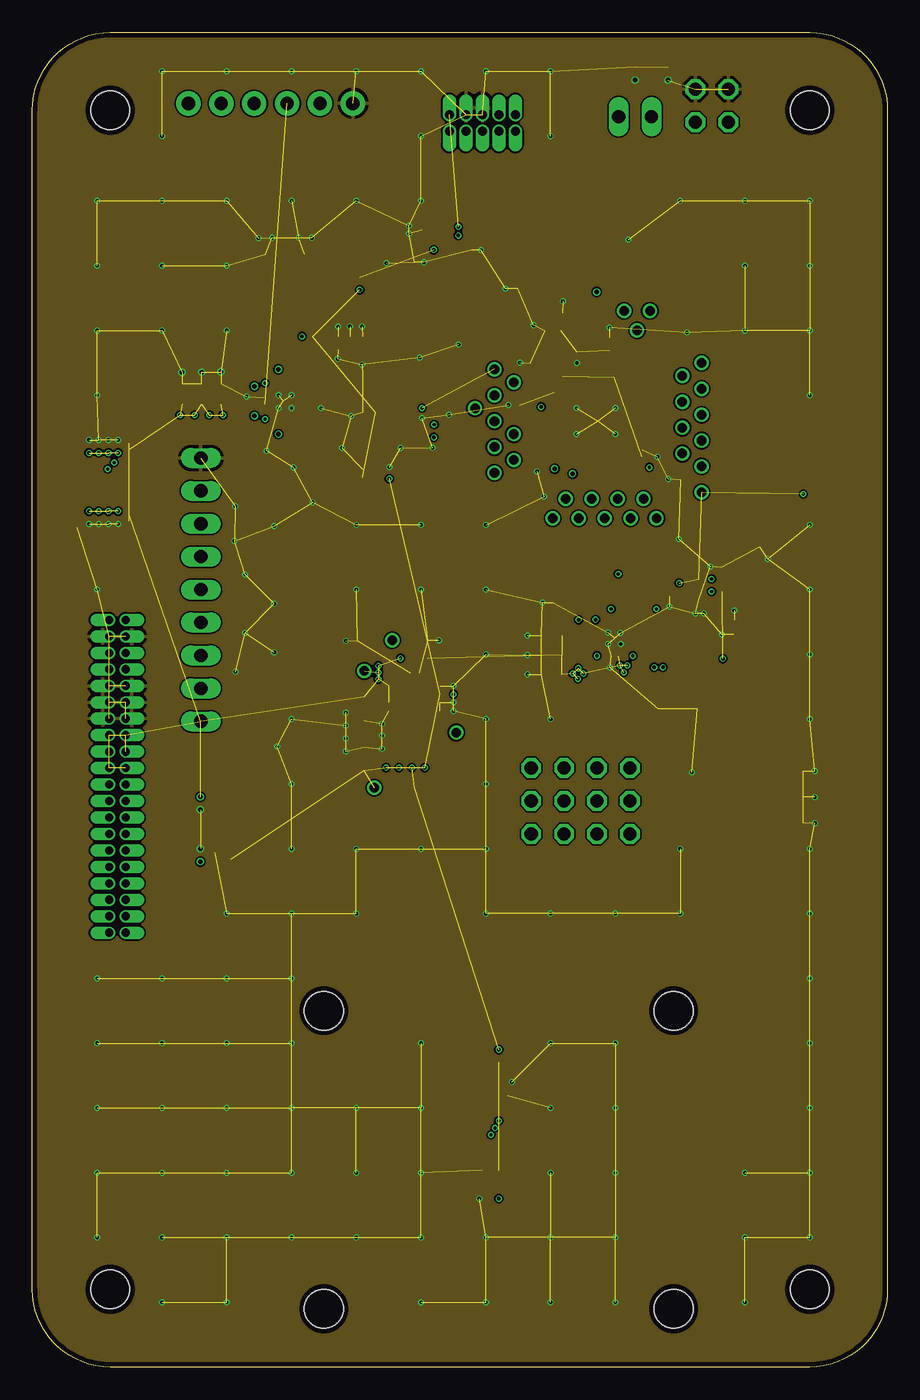
[diagram p5: board, inner layer Route15]
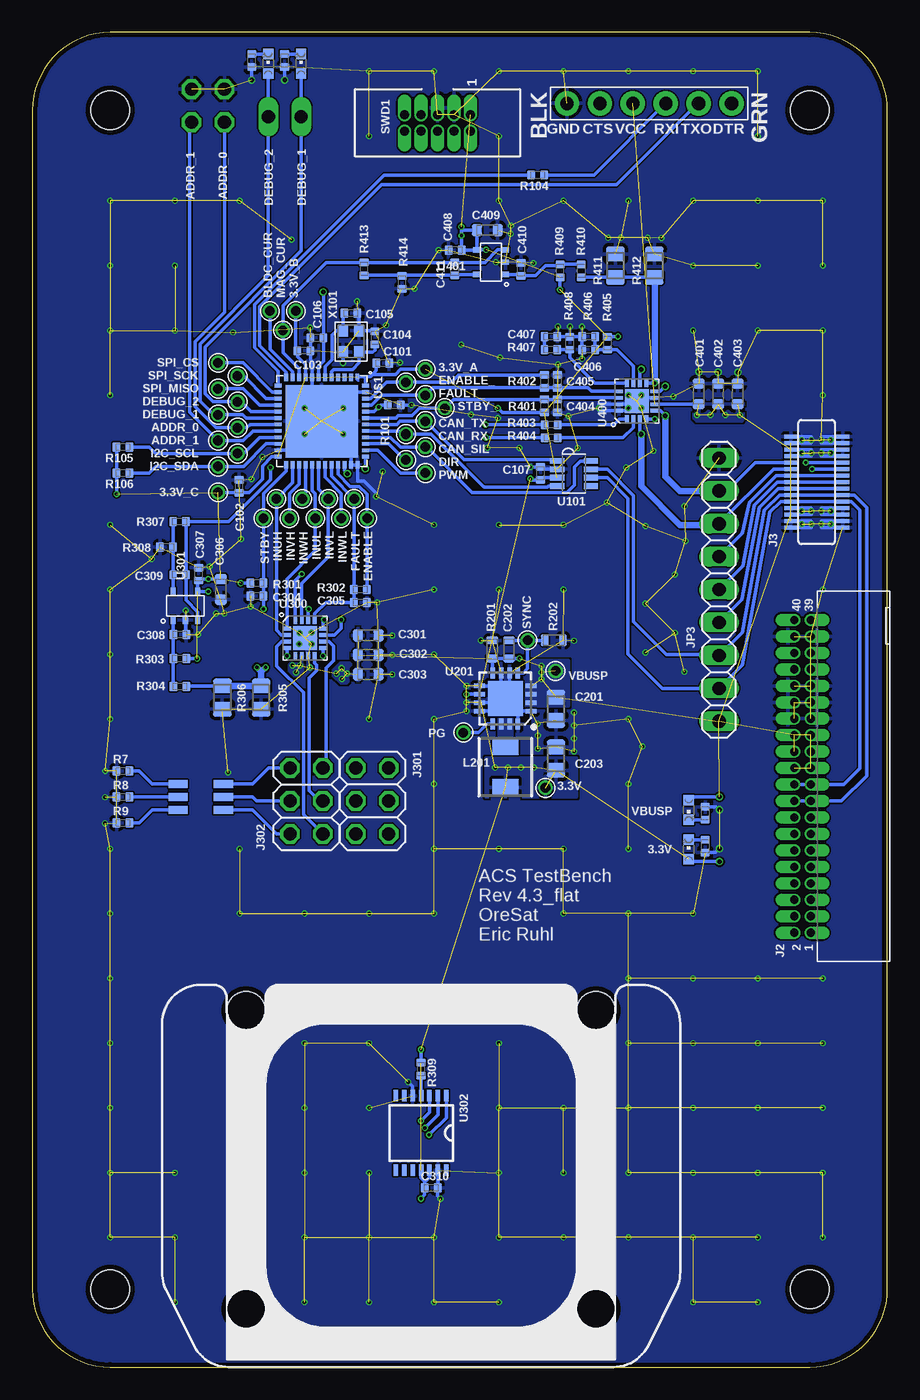
[diagram p6: board, bottom side, seen from below]

Size 66 x 103 mm. Coordinates in mm from the lower left corner, seen from the top.
Outline: 6,103 60,103 arc-90 66,97 66,6 arc-90 60,0 6,0 arc-90 0,6 0,97 arc-90 6,103
Copper layers (1*2*15*16): Top 0.035559375mm / dielectric 0.17018125mm / Route2 0.01778125mm / dielectric 47mil / Route15 0.01778125mm / dielectric 0.17018125mm / Bottom 0.035559375mm
Design rules "Osh park 4 layer *": minimum track width 5mil, minimum drill 10mil, track to track 5mil, track to pad 5mil, pad to pad 5mil, via to via 5mil, smd to smd 5mil, copper to edge 15mil, drill to drill 6mil, minimum pad ring 4mil, minimum via ring 4mil, stop-mask expansion 2.5mil, vias tented up to drill 11mil, thermal gap 10mil
Holes 3 mm at 22.5,4.5 49.5,4.5 49.5,27.5 22.5,27.5 60,97 6,97 6,6 60,6
tKeepout: area 20,25 to 25,30; area 20,2 to 25,7; area 47,2 to 52,7; area 47,25 to 52,30

### Footprints (pad centres in the part's own frame; a part is rotated, then mirrored left to right if it is on the bottom)
1X01 = drill 0.737 pad 1.1: 1 0,0
.0402-B-NOSILK = smd 0.6 x 0.7: 1 -0.5,0; 2 0.5,0
.0805-B-NOSILK = smd 1.15 x 1.45: 1 -0.9,0; 2 0.9,0
.0603-C-NOSILK = smd 0.6 x 0.9: 1 -0.7,0; 2 0.7,0
.0603-B-NOSILK = smd 0.8 x 0.95: 1 -0.8,0; 2 0.8,0
6_PIN_SERIAL_TARGET_SIDE_W_SILK = drill 1.016 pad 1.88: P$1 -6.35,0; P$2 -3.81,0; P$3 -1.27,0; P$4 1.27,0; P$5 3.81,0; P$6 6.35,0
J-SAMTEC-TFM-120-X1-XXX-D-RA = drill 0.635 pad 0.965 offset: 1 12.065,0.635; 2 12.065,-0.635; 3 10.795,0.635; 4 10.795,-0.635; 5 9.525,0.635; 6 9.525,-0.635; 7 8.255,0.635; 8 8.255,-0.635; 9 6.985,0.635; 10 6.985,-0.635; 11 5.715,0.635; 12 5.715,-0.635; 13 4.445,0.635; 14 4.445,-0.635; 15 3.175,0.635; 16 3.175,-0.635; 17 1.905,0.635; 18 1.905,-0.635; 19 0.635,0.635; 20 0.635,-0.635; 21 -0.635,0.635; 22 -0.635,-0.635; 23 -1.905,0.635; 24 -1.905,-0.635; 25 -3.175,0.635; 26 -3.175,-0.635; 27 -4.445,0.635; 28 -4.445,-0.635; 29 -5.715,0.635; 30 -5.715,-0.635; 31 -6.985,0.635; 32 -6.985,-0.635; 33 -8.255,0.635; 34 -8.255,-0.635; 35 -9.525,0.635; 36 -9.525,-0.635; 37 -10.795,0.635; 38 -10.795,-0.635; 39 -12.065,0.635; 40 -12.065,-0.635
MEZZANINE_PLUG = smd 0.3 x 1: P$1 -3.5,2; P$2 -3,2; P$3 -2.5,2; P$4 -2,2; P$5 -1.5,2; P$6 -1,2; P$7 -0.5,2; P$8 0,2; P$9 0.5,2; P$10 1,2; P$11 1.5,2; P$12 2,2; P$13 2.5,2; P$14 3,2; P$15 3.5,2; P$16 3.5,-2; P$17 3,-2; P$18 2.5,-2; P$19 2,-2; P$20 1.5,-2; P$21 1,-2; P$22 0.5,-2; P$23 0,-2; P$24 -0.5,-2; P$25 -1,-2; P$26 -1.5,-2; P$27 -2,-2; P$28 -2.5,-2; P$29 -3,-2; P$30 -3.5,-2
2X03 = drill 1.016 octagon: 1 -2.54,-1.27; 2 -2.54,1.27; 3 0,-1.27; 4 0,1.27; 5 2.54,-1.27; 6 2.54,1.27
1X02 = drill 1.016 long: 1 -1.27,0; 2 1.27,0
2X02 = drill 1.016 octagon: 1 -1.27,-1.27; 2 -1.27,1.27; 3 1.27,-1.27; 4 1.27,1.27
1X09 = drill 1.016 long: 1 -10.16,0; 2 -7.62,0; 3 -5.08,0; 4 -2.54,0; 5 0,0; 6 2.54,0; 7 5.08,0; 8 7.62,0; 9 10.16,0
ECS-MPI4040 = smd 2 x 1.3: 1 0,1.575; 2 0,-1.575
CHIPLED_0603 = smd 0.8 x 0.8: A 0,-0.75; C 0,0.75
CLX6E-FKC = smd 0.6 x 1.5: P$1 -1,-1.75; P$2 0,-1.75; P$3 1,-1.75; P$4 1,1.75; P$5 0,1.75; P$6 -1,1.75
1.27MM_2X5 = drill 0.7 pad 1.016 offset: !RESET 0.635,-2.54; GND -0.635,1.27; GND@2 -0.635,0; GNDDET -0.635,-2.54; KEY -0.635,-1.27; NC 0.635,-1.27; SWDCLK 0.635,1.27; SWDIO 0.635,2.54; SWO 0.635,0; VTREF -0.635,2.54
SOT23-8_TI-DCN = smd 0.45 x 1.1: 1 -0.975,-1.3; 2 -0.325,-1.3; 3 0.325,-1.3; 4 0.975,-1.3; 5 0.975,1.3; 6 0.325,1.3; 7 -0.325,1.3; 8 -0.975,1.3
S-PVQFN-16 = smd 0.85 x 0.35: 1 -1.975,0.975; 2 -1.975,0.325; 3 -1.975,-0.325; 4 -1.975,-0.975; 9 1.975,-0.975; 10 1.975,-0.325; 11 1.975,0.325; 12 1.975,0.975 | smd 0.35 x 0.85: 5 -0.975,-1.975; 6 -0.325,-1.975; 7 0.325,-1.975; 8 0.975,-1.975; 13 0.975,1.975; 14 0.325,1.975; 15 -0.325,1.975; 16 -0.975,1.975 | smd 2.7 x 2.7: PAD 0,0
VFQPN = smd 0.63 x 0.3: 1 -1.39,0.75; 2 -1.39,0.25; 3 -1.39,-0.25; 4 -1.39,-0.75; 9 1.39,-0.75; 10 1.39,-0.25; 11 1.39,0.25; 12 1.39,0.75 | smd 0.3 x 0.63: 5 -0.75,-1.39; 6 -0.25,-1.39; 7 0.25,-1.39; 8 0.75,-1.39; 13 0.75,1.39; 14 0.25,1.39; 15 -0.25,1.39; 16 -0.75,1.39 | smd 1.85 x 1.85: EPAD 0,0
SOT23-5 = smd 0.6 x 0.4: 1 -1.1,0.95; 2 -1.1,0; 3 -1.1,-0.95; 4 1.1,-0.95; 5 1.1,0.95
TSSOP14 = smd 0.9 x 0.35: 1 -2.875,1.95; 2 -2.875,1.3; 3 -2.875,0.65; 4 -2.875,0; 5 -2.875,-0.65; 6 -2.875,-1.3; 7 -2.875,-1.95; 8 2.875,-1.95; 9 2.875,-1.3; 10 2.875,-0.65; 11 2.875,0; 12 2.875,0.65; 13 2.875,1.3; 14 2.875,1.95
QFPN-48 = smd 0.38 x 0.28: 1 -3.45,2.75 | smd 0.55 x 0.3: 2 -3.375,2.25; 3 -3.375,1.75; 4 -3.375,1.25; 5 -3.375,0.75; 6 -3.375,0.25; 7 -3.375,-0.25; 8 -3.375,-0.75; 9 -3.375,-1.25; 10 -3.375,-1.75; 11 -3.375,-2.25; 12 -3.375,-2.75; 25 3.375,-2.75; 26 3.375,-2.25; 27 3.375,-1.75; 28 3.375,-1.25; 29 3.375,-0.75; 30 3.375,-0.25; 31 3.375,0.25; 32 3.375,0.75; 33 3.375,1.25; 34 3.375,1.75; 35 3.375,2.25; 36 3.375,2.75 | smd 0.3 x 0.55: 13 -2.75,-3.375; 14 -2.25,-3.375; 15 -1.75,-3.375; 16 -1.25,-3.375; 17 -0.75,-3.375; 18 -0.25,-3.375; 19 0.25,-3.375; 20 0.75,-3.375; 21 1.25,-3.375; 22 1.75,-3.375; 23 2.25,-3.375; 24 2.75,-3.375; 37 2.75,3.375; 38 2.25,3.375; 39 1.75,3.375; 40 1.25,3.375; 41 0.75,3.375; 42 0.25,3.375; 43 -0.25,3.375; 44 -0.75,3.375; 45 -1.25,3.375; 46 -1.75,3.375; 47 -2.25,3.375; 48 -2.75,3.375 | smd 5.6 x 5.6: EPAD 0,0
CRYSTAL_2.5X2 = smd 0.9 x 0.8: 1 -0.825,-0.625; 2 0.825,-0.625; 3 0.825,0.625; 4 -0.825,0.625

### Placement (x,y rotation side)
3.3V  26.4,44.7 180 bottom
3.3V_A  35.67,77 90 top
3.3V_B  45.67,81.5 90 top
3.3V_C  51.67,67.5 90 top
ADDR_0  50.17,72.5 90 top
ADDR_1  51.67,71.5 90 top
BLDC_CUR  47.67,81.5 90 top
C101  38.96,77.47 0 bottom
C102  50.04,67.97 90 bottom
C103  45.05,78.43 0 bottom
C104  39.57,79.43 90 bottom
C105  41.42,81.33 0 bottom
C106  44.04,79.43 180 bottom
C107  26.79,68.96 90 bottom
C201  25.6,50.8 270 bottom
C202  30.51,55.39 90 bottom
C203  25.58,46.96 90 bottom
C301  40.08,56.46 0 bottom
C302  40.08,54.96 0 bottom
C303  40.08,53.46 0 bottom
C304  48.67,59.5 180 bottom
C305  40.68,59 0 bottom
C306  51.46,60.02 270 bottom
C307  53.17,61.2 90 bottom
C308  54.63,56.53 0 bottom
C309  54.64,61.15 180 bottom
C310  35.22,13.83 0 bottom
C401  14.57,75.1 90 bottom
C402  13.07,75.1 90 bottom
C403  11.57,75.1 90 bottom
C404  25.48,74.17 270 bottom
C405  25.48,76.07 90 bottom
C406  23.08,78.52 180 bottom
C407  25.98,79.52 0 bottom
C408  33.38,86.2 180 bottom
C409  30.89,87.74 0 bottom
C410  28.29,84.72 90 bottom
C411  33.4,84.75 270 bottom
CAN_RX  37.17,72 90 top
CAN_SIL  35.67,71 90 top
CAN_TX  35.67,73 90 top
DEBUG_1  51.67,73.5 90 top
DEBUG_2  50.17,74.5 90 top
DIR  37.17,70 90 top
ENABLE  40.17,65.5 270 bottom
ENABLE_  37.17,76 90 top
FAULT  41.17,67 90 top
FAULT_  35.67,75 90 top
I2C_SCL  50.17,70.5 180 top
I2C_SDA  51.67,69.5 90 top
INUH  47.17,67 90 top
INUL  44.17,65.5 90 top
INVH  46.17,65.5 90 top
INVL  43.17,67 90 top
INWH  45.17,67 90 top
INWL  42.17,65.5 90 top
J1  18.39,97.52 180 bottom
J2  6.56,45.59 270 bottom
J3  5.47,68.3 90 bottom
J301  39.77,43.69 270 bottom
J302  44.85,43.69 90 bottom
JP1  46.52,96.49 180 top
JP2  52.45,97.34 0 top
JP3  13,60 90 bottom
L201  29.5,46.3 0 bottom
LED1  15.34,42.99 180 bottom
LED2  15.34,39.95 0 bottom
LED3  45.26,100.58 0 bottom
LED4  47.8,100.58 0 bottom
LED301  53,44 270 bottom
MAG_CUR  46.67,80 90 top
PG  32.73,48.97 180 bottom
PWM  35.67,69 90 top
R1  14.07,42.74 270 bottom
R2  14.07,40.2 90 bottom
R3  46.53,100.83 90 bottom
R4  49.07,100.82 90 bottom
R7  59,46 0 bottom
R8  59,44 0 bottom
R9  59,42 0 bottom
R101  38.08,74.25 180 bottom
R104  27,92 180 bottom
R105  59,71 180 bottom
R106  59,69 180 bottom
R201  29.22,55.39 270 bottom
R202  25.75,56.09 180 bottom
R301  48.67,60.5 0 bottom
R302  40.68,60 0 bottom
R303  54.63,54.67 0 bottom
R304  54.63,52.53 180 bottom
R305  48.34,51.67 90 bottom
R306  51.34,51.67 90 bottom
R307  54.64,65.26 0 bottom
R308  55.64,63.28 0 bottom
R309  36.01,23 270 bottom
R401  26.48,74.17 90 bottom
R402  26.48,76.07 90 bottom
R403  25.97,72.72 180 bottom
R404  25.97,71.72 180 bottom
R405  21.63,79.02 270 bottom
R406  23.08,79.52 180 bottom
R407  25.98,78.52 180 bottom
R408  24.53,79.02 90 bottom
R409  25.27,84.61 270 bottom
R410  23.64,84.61 90 bottom
R411  21,85 90 bottom
R412  18,85 90 bottom
R413  40.4,84.75 90 bottom
R414  37.46,83.71 90 bottom
SPI_CS  51.67,77.5 90 top
SPI_MISO  51.67,75.5 90 top
SPI_SCK  50.17,76.5 90 top
STBY  48.17,65.5 90 top
STBY_  34.17,74 90 top
SWD1  34.73,96.02 270 bottom
SYNC  27.78,56.09 0 bottom
U101  24.2,68.96 270 bottom
U201  29.5,51.6 180 bottom
U300  44.96,56.25 0 bottom
U301  54.19,58.75 90 bottom
U302  36,18.07 270 bottom
U400  19.36,74.55 90 bottom
U401  30.6,85.27 180 bottom
U$1  43.67,73 270 bottom
VBUSP  25.62,53.72 0 top
X101  41.41,79.15 270 bottom

### Tracks (layer width: path | path; a pad name or v marks a point on that pad's centre or on a via)
3.3V  (via drill 0.26, 0.35)  (23 unrouted)
  Bottom 0.26: LED2.A 15.16,39.01 v12.97,39.01 | U$1.24 47.52,70.25 48.22,69.55 48.22,68.53 49.29,67.47 C102.1 50.04,67.5 3.3V_C.1 | U$1.9 44.92,77.36 45.55,77.99 C103.1 45.67,78.43 3.3V_B.1 | 3.3V_A.1 37.58,77 37.99,76.59 39.76,76.59 | U$1.1 40.29,76.45 | 40.29,76.45 U$1.48 | 40.29,76.45 39.9,76.45 39.76,76.59 | C101.1 39.46,76.89 39.76,76.59 | U101.3 26.61,68.64 C107.1 27.46,68.46 v27.56,68.56 | C306.1 v52.42,60.82 53.05,60.82 C307.1 53.24,60.63 U301.4 v52.42,59.85 | R309.1 v36,24.5 | C310.1 35.72,14.35 36,14.62 U302.11 | C310.1 35.72,14.27 35.35,14.63 U302.12 | C310.1 35.72,13.28 v36,13 | R405.1 v20.82,79.52 v20.81,79.53 | U401.4 31.72,86.2 C408.1 v32.88,87.33 32.88,87.74 | U401.4 C409.1 32.88,87.74 | U401.4 v30.98,86.22 | 32.88,87.74 v32.88,87.98 v32.89,87.99 | R303.2 v53.3,54.67 | R301.1 v49.92,60.5 | U201.10 v32.49,51.92 v32.5,51.92 | R105.2 R106.2 v59.5,67.37 | R401.1 29.73,73.67 v30.07,74.01 | R409.2 v25.27,83.14
  other vias: 30.29,46.26 29.29,46.26 28.29,46.26 27.29,46.26
  pour Bottom: 31,47 24,47 24,44 31,44
  pour Route2 (isolate 0.3, rank 2): 66,97 66,6 arc-90 60,0 6,0 arc-90 0,6 0,97 arc-90 6,103 60,103 arc-90
250_REF
  Bottom 0.26: R406.1 C406.1 R405.2 20.87,78.52 19.61,77.26 U400.11
250_TOFF
  Bottom 0.26: R407.1 R408.1 24.53,77.89 22.58,75.94 U400.12
ADDR_0
  Bottom 0.26: U$1.19 49.2,72.75 49.45,72.5 ADDR_0.1 51.81,72.5 53.45,74.14 53.45,79.13 51.18,81.4 JP2.1
ADDR_1
  Bottom 0.26: U$1.20 48.97,72.25 49.72,71.5 ADDR_1.1 53.86,73.69 53.86,95.93 JP2.3
AS5047_MOSI
  Bottom 0.26: R309.2 U302.4
B_IN+
  Bottom 0.26: R304.2 R303.1 C308.1 55.13,57.64 U301.1
B_IN-
  Bottom 0.26: R307.1 55.14,65.21 R308.2 C309.2 U301.5
BLDC_CURR_FDB  (via drill 0.26)
  Top 0.26: v47.62,69.43 47.67,69.47 BLDC_CUR.1
  Bottom 0.26: U$1.11 45.92,76.82 47.67,78.57 BLDC_CUR.1 | U301.3 53.24,58.28 54.14,59.18 C309.1 R307.2 50.87,65.26 47.62,68.5 v47.62,69.43
BLDC_EN
  Bottom 0.26: U$1.33 42.42,68.92 41.47,67.97 40.78,67.97 40.17,67.36 ENABLE.1 R302.2
BLDC_FAULT
  Bottom 0.26: U$1.32 42.92,68.75 FAULT.1 R302.1 C305.1 43.35,59 44.21,58.14 U300.13
BLDC_INUH
  Bottom 0.26: U$1.26 45.92,68.25 INUH.1 47.17,56.88 46.78,56.5 U300.2
BLDC_INUL
  Bottom 0.26: U$1.29 44.42,67.66 44.17,67.41 INUL.1 44.17,63 46.35,60.82 U300.1
BLDC_INVH  (via drill 0.26)
  Top 0.26: INVH.1 46.17,62.41 45.22,61.46 v45.22,61.2
  Bottom 0.26: U$1.27 45.42,68.14 46.17,67.39 INVH.1 | v45.22,61.2 45.71,60.71 U300.16
BLDC_INVL
  Bottom 0.26: U$1.30 43.92,67.75 INVL.1 43.17,62.5 45.21,60.46 U300.15
BLDC_INWH  (via drill 0.26)
  Top 0.26: INWH.1 45.17,62.87 43.48,61.18 v43.48,57.68
  Bottom 0.26: U$1.28 44.92,67.25 INWH.1 | v43.48,57.68 43.57,57.59 U300.12
BLDC_INWL  (via drill 0.26)
  Top 0.26: INWL.1 v42.17,57.69 v42.16,57.68
  Bottom 0.26: U$1.31 43.42,68.67 42.17,67.42 INWL.1 | U300.11 42.67,56.5 42.16,57.01 v42.16,57.68
BLDC_STBY  (via drill 0.26)
  Top 0.26: v48.17,58.5 v44.67,58.5
  Bottom 0.26: U$1.25 46.42,69.16 48.17,67.41 STBY.1 R301.2 C304.1 v48.17,58.5 | v44.67,58.5 44.71,58.46 U300.14
BOOT  (via drill 0.26)
  Top 0.26: v39.27,74.1 37.98,72.81 37.98,69.67 36.31,68 25,68 19.54,62.54 JP3.6
  Bottom 0.26: U$1.44 39.62,73.75 v39.27,74.1 39.12,74.25 R101.2 | JP3.6 11.19,64.35 10.65,66.72 8.57,68.8 J3.P$9 J3.P$22
CAN_H
  Bottom 0.26: J2.18 J2.17 3.56,43.69 1.61,45.64 1.61,66.34 2.57,67.3 J3.P$25 J3.P$6 8.32,67.3 9.49,66.13 11.22,56.7 JP3.3 13.08,55 17.06,55 19.61,57.55 19.61,67.26 21.64,69.28 U101.7
CAN_L
  Bottom 0.26: J2.20 J2.19 3.37,44.95 2.14,46.18 2.14,66.14 2.8,66.8 J3.P$26 J3.P$5 8.24,66.8 9.07,65.97 11.2,54.18 JP3.2 17.38,52.38 20.02,55.02 20.02,67.02 21.64,68.64 U101.6
CAN_RX
  Bottom 0.26: U$1.41 37.61,72.25 37.36,72 CAN_RX.1 35.24,72 31.14,67.9 26.23,67.9 26.15,67.98 U101.4
CAN_SILENT
  Bottom 0.26: U$1.40 38.35,71.75 37.6,71 CAN_SIL.1 35.56,71 32.06,67.5 24.74,67.5 24.18,68.06 24.18,69.45 23.7,69.94 U101.8
CAN_TX
  Bottom 0.26: U$1.42 37.86,72.75 37.61,73 CAN_TX.1 35.65,73 32.68,70.03 25.59,70.03 U101.1
CLK1
  Bottom 0.26: U$1.5 42.92,76.82 42.76,76.98 41.31,76.98 40.78,77.5 X101.3 39.73,78.33 39.57,78.49 C104.1
CLK2
  Bottom 0.26: U$1.6 43.42,77.2 42.87,77.75 42.87,79.64 42.53,79.97 X101.1 42.03,81.22 C105.1
DEBUG_1
  Bottom 0.26: U$1.18 49.51,73.25 49.76,73.5 DEBUG_1.1 52.02,73.5 53.06,74.55 53.06,78.95 47.79,84.22 JP1.1 LED4.A
DEBUG_2
  Bottom 0.26: U$1.17 49.14,73.75 49.89,74.5 DEBUG_2.1 52.05,74.5 52.67,75.12 52.67,78.73 45.25,86.16 JP1.2 LED3.A
GND  (via drill 0.25, 0.26, 0.35)  (270 unrouted)
  Bottom 0.26: U$1.47 41.42,75.25 U$1.EPAD | U$1.EPAD 44.42,73.75 U$1.8 44.42,77.61 44.55,77.74 C103.2 C106.2 | U$1.23 45.92,70.75 U$1.EPAD | X101.2 v42.03,77.5 v42.03,77.49 | C105.2 40.78,81.19 X101.4 39.61,79.97 C104.2 | R101.1 v36.75,74.25 | U$1.EPAD 41.42,70.75 U$1.35 U$1.36 40.92,68.36 40.39,68.36 39.44,67.4 39.44,67.22 v39.47,67.2 | C308.2 54.19,56.59 U301.2 | U101.2 26.61,69.28 C107.2 v27.56,69.46 | C407.2 R408.2 R406.2 C406.2 | U302.13 34.7,13.85 C310.2 34.72,13.22 v34.5,13 | U302.5 36.65,21.65 v37,22 | R3.1 v46.53,99.31 | R4.1 v49.07,99.31 | R2.1 13.28,39.7 v12.97,40.01 | R1.1 13.2,43.24 v12.97,43.01 | U400.EPAD 19.36,74.3 U400.15 22.28,74.3 v22.28,74 22.28,73.8 U400.16 20,73.8 v20,74 | U400.7 19,74.8 v19,75 | J3.P$15 5.87,71.8 v5.87,71.55 5.87,71.3 J3.P$14 | J3.P$17 5.12,71.3 v5.12,71.55 5.12,71.8 J3.P$16 | J3.P$2 5.87,65.3 v5.87,65.05 5.87,64.8 J3.P$1 | J3.P$29 5.12,65.3 v5.12,65.05 5.12,64.8 J3.P$30 | U300.EPAD 45.41,56.25 v45.41,55.8 | U201.7 29.82,52.58 | 29.82,52.58 U201.9 | U201.6 29.18,52.58 29.82,52.58 | U201.1 U201.12 | U201.16 28.52,51.27 U201.11 29.82,51.27 U201.PAD
  other vias: 25.44,77.38 11.54,76.76 13.07,76.78 14.55,76.8 38.22,56.46 38.22,54.96 38.22,53.46 39.38,59 56.78,62.37 52.33,61.78 51.82,58.17 51.18,58.17 49.16,58.7 60.38,46 60.39,43.98 60.4,41.97 54.17,58.39 49.08,68.53 48.25,70.24 45,72 45,74 42,74 42,72 44.55,80.21 40.94,82.25 38.69,80.4 37.62,77.52 36.51,83.22 34.64,86.2 29.08,87.46 29.06,88.07 27.32,85.19 30.23,85.26 25.45,80.31 24.51,80.31 23.59,80.3 23.57,77.81 24.61,73.39 19,74 20,75 16.53,74.91 45.39,56.66 44.44,56.69 44.44,55.8 44.56,53.99 6.62,65.05 6.62,71.55 4.37,71.55 4.37,65.05 30.89,70.95 28.41,70.93 23.91,70.93 32.15,73.49 30.08,73.23 20.16,69.43 15.66,66.43 18.07,70.71 18.67,64.91 15.59,63.76 16.42,61.16 16.42,56.66 18.67,58.91 18.67,55.16 15.67,53.66 38.96,69.12 30,90 46,87 50.52,79.85 32.9,78.9 29.9,77.9 21.64,66.73 18.9,47.9 50.9,45.9 49.9,63.9 60,10 60,15 60,20 60,25 60,30 60,50 60,55 60,60 60,65 60,75 60,80 60,85 10,95 5,90 5,85 5,80 5,75 5,60 5,15 5,10 10,5 15,5 30,5 35,5 40,5 45,5 55,5 45,10 40,10 35,10 30,10 25,10 20,10 15,10 10,10 10,15 15,15 20,15 25,15 30,15 40,15 45,15 55,15 55,10 30,20 25,20 40,20 45,20 45,25 40,25 30,25 15,20 20,20 20,25 15,25 20,30 15,30 10,90 10,85 10,80 15,100 10,100 21.56,87.15 20.56,87.15 18.51,87.15 17.45,87.13 53.21,56.54 32.5,51.28 32.5,52.58 32.5,50.62 24.19,47.51 24.19,48.51 24.19,49.51 24.19,50.51 24.19,56.05 31.39,56.08 27,49.65 26.99,48.73 26.99,47.72 10,20 10,25 10,30 5,25 5,30 5,20 15,35 20,35 25,35 35,35 40,35 45,35 50,35 50,40 60,40 60,35 35,40 30,40 25,40 20,40 20,45 20,50 25,60 30,60 35,60 35,65 30,65 25,65 35,50 35,45 35,55 40,50 20,100 25,100 30,100 35,100 40,100 40,95 30,95 15,90 15,85 15,80 20,90 25,90 50,90 55,90 60,90 55,85 55,80
  pour Bottom (rank 6): 6,103 60,103 arc-90 66,97 66,6 arc-90 60,0 6,0 arc-90 0,6 0,97 arc-90
  pour Route15 (rank 6): 6,103 60,103 arc-90 66,97 66,6 arc-90 60,0 6,0 arc-90 0,6 0,97 arc-90
  pour Top (rank 6): 66,6 66,97 arc90 60,103 6,103 arc90 0,97 0,6 arc90 6,0 60,0 arc90
  pour Bottom: 7.84,65.32 3.09,65.32 3.09,64.78 7.84,64.78
  pour Bottom: 7.84,71.82 3.09,71.82 3.09,71.28 7.84,71.28
I2C_SCL
  Top 0.26: I2C_SCL.1 47.61,67.94 37.49,67.94 36.77,67.23 25.32,67.23 15.55,57.46 JP3.4
  Bottom 0.26: U$1.21 48.46,71.75 49.71,70.5 I2C_SCL.1 56.5,70.5 57,71 R105.1 | JP3.4 11.23,59.23 9.88,66.34 8.42,67.8 J3.P$7 J3.P$24
I2C_SDA
  Top 0.26: I2C_SDA.1 51.67,70.28 50.55,71.39 49.79,71.39 49.27,70.87 49.27,70.19 47.44,68.35 37.35,68.35 36.61,67.61 25.16,67.61 17.55,60 JP3.5
  Bottom 0.26: U$1.22 47.96,71.25 49.71,69.5 I2C_SDA.1 56.5,69.5 57,69 R106.1 | JP3.5 11.17,61.83 10.27,66.52 8.49,68.3 J3.P$8 J3.P$23
M_IN+
  Bottom 0.26: U401.1 28.39,84.32 C410.1 27.18,84.22 26.4,85 25.38,85 R409.1 R410.2
M_IN-
  Bottom 0.26: U401.5 33.33,84.32 C411.2 37.42,84.25 | 37.42,84.25 R414.2 | R413.1 37.42,84.25
M_PH
  Bottom 0.26: R403.1 21.12,72.72 20.68,73.16 U400.1
M_PWM
  Bottom 0.26: R404.1 20.41,71.72 19.61,72.52 U400.2
MAG_CURR_FDB
  Bottom 0.26: U$1.10 45.42,77.05 46.67,78.3 MAG_CUR.1 46.67,81.93 43.35,85.25 R413.2 C411.1 31.06,85.25 30.09,86.22 U401.3
MAG_DIR  (via drill 0.26)
  Top 0.26: v31.02,72.73 33.03,72.73 33.45,72.31 33.45,71.8 35.24,70 DIR.1
  Bottom 0.26: U$1.39 38.5,71.25 37.25,70 DIR.1 | v31.02,72.73 R403.2
MAG_EN
  Bottom 0.26: U$1.46 39.9,74.75 38.65,76 ENABLE_.1 33.67,76 33.1,76.57 R402.2
MAG_FAULT
  Bottom 0.26: U$1.45 39.81,74.25 39.06,75 FAULT_.1 35.1,75.57 R402.1 C405.1 23.11,75.57 22.84,75.3 U400.13
MAG_PWM  (via drill 0.26)
  Top 0.26: PWM.1 35.64,69 32.93,71.71 31.02,71.71 v30.99,71.74
  Bottom 0.26: PWM.1 37.6,69 39.35,70.75 U$1.38 | v30.99,71.74 26.49,71.74 R404.2
MAG_STBY
  Bottom 0.26: U$1.43 37.93,73.25 37.77,73.41 36.72,73.41 36.13,74 STBY_.1 33.5,74.67 R401.2 C404.1 25.35,74.8 U400.14
N$1
  Bottom 0.26: J302.2 47.15,41.15 49,43 LED301.P$4
N$2
  Bottom 0.26: J302.4 48.69,43.69 49,44 LED301.P$5
N$3
  Bottom 0.26: J302.6 47.77,46.23 49,45 LED301.P$6
N$4
  Top 0.26: J301.5 J301.6
N$5
  Bottom 0.26: LED4.C 49.06,101.33 R4.2
N$6
  Bottom 0.26: LED3.C R3.2
N$7
  Bottom 0.26: LED1.C R1.2
N$8
  Bottom 0.26: LED2.C R2.2
N$9
  Top 0.26: J301.3 J301.4
N$10
  Top 0.26: J301.1 J301.2
N$14
  Bottom 0.26: LED301.P$1 56.75,45 57.75,46 R7.2
N$15
  Bottom 0.26: LED301.P$2 R8.2
N$16
  Bottom 0.26: R9.2 57.75,42 56.75,43 LED301.P$3
NRST  (via drill 0.35)
  Top 0.26: v43.56,82.96 43.56,83.44 37.27,89.73 SWD1.!RESET
  Bottom 0.26: U$1.7 43.92,77.25 43.54,77.63 C106.1 43.54,82.94 v43.56,82.96
OUT1  (via drill 0.25, 0.35)
  Top 0.26: v19,77 18.46,76.46 18.46,72.54 v19,72 | JP3.7 8.78,69.3 v5.82,69.3
  Bottom 0.26: U400.10 19.11,76.89 v19,77 | U400.3 19.11,72.11 v19,72 | 13.08,65 JP3.7 8.78,69.3 J3.P$10 | v5.82,69.3 J3.P$21
  Bottom 0.52: v19,72 19,67.98 16.02,65 13.08,65
OUT2  (via drill 0.25, 0.35)
  Top 0.26: v17.15,75.68 v17.15,73.41 | JP3.8 12.38,67.62 10.2,69.8 v6.31,69.8
  Bottom 0.26: U400.8 17.53,75.3 v17.15,75.68 | v17.15,73.41 17.54,73.8 U400.5 | JP3.8 12.38,67.62 10.2,69.8 J3.P$11 | v6.31,69.8 J3.P$20
  Bottom 0.52: v17.15,73.41 17.15,68.73 16.04,67.62 JP3.8
SENSE_BLDC  (via drill 0.26)
  Top 0.26: v43.58,54.89 v46.35,54.89
  Top 0.52: v46.35,54.89 47.11,54.89 v48,54 v48.67,54
  Bottom 0.26: U300.9 43.57,54.9 v43.58,54.89 | v46.35,54.89 U300.4 | R306.2 54.09,52.57 R304.1
  Bottom 0.52: v48,54 48.34,53.66 R305.2 | R305.2 48.34,53.67 v48.67,54 | R305.2 R306.2
SENSE_MAG  (via drill 0.26)
  Top 0.26: v17.97,73.16 v17.97,75.94
  Bottom 0.26: U400.4 v17.97,73.16 | v17.97,75.94 U400.9 | R412.1 R411.1 R410.1
  Bottom 0.52: R412.1 17.97,84.07 v17.97,75.94
SPI1_CS  (via drill 0.25)
  Top 0.26: SPI_CS.1 52.06,77.5 56.18,73.38 56.18,22.08 52.02,17.93 v35.39,17.93
  Bottom 0.26: SPI_CS.1 49.74,77.5 47.49,75.25 U$1.14 | v35.39,17.93 35.38,17.92 34.05,19.25 U302.1
SPI1_MISO  (via drill 0.25)
  Top 0.26: SPI_MISO.1 52.02,75.5 54.74,72.78 54.74,22.74 51,19 v36,19
  Bottom 0.26: U$1.16 48.48,74.25 49.73,75.5 SPI_MISO.1 | v36,19 35.35,19.65 U302.3
SPI1_SCK  (via drill 0.25)
  Top 0.26: SPI_SCK.1 50.19,76.52 52.06,76.52 55.48,73.11 55.48,22.43 51.5,18.45 v35.71,18.45
  Bottom 0.26: U$1.15 47.96,74.75 49.71,76.5 SPI_SCK.1 | v35.71,18.45 35.71,18.47 34.7,19.48 U302.2
SWCLK  (via drill 0.35)
  Top 0.26: v40.3,69.33 40.15,69.48 40.15,86.2 33.46,92.89 SWD1.SWDCLK
  Bottom 0.26: U$1.37 v40.3,69.33
SWDIO  (via drill 0.35)
  Top 0.26: v41.69,68.95 41.54,68.8 40.04,68.8 39.77,69.07 39.77,86.04 32.19,93.61 SWD1.SWDIO
  Bottom 0.26: U$1.34 41.92,69.17 v41.69,68.95
TOFF1
  Bottom 0.26: R407.2 C407.1
TPS62111-PG2
  Bottom 0.26: U201.13 30.91,49.62 31.57,48.97 PG.1
TPS62111-SYNC2
  Bottom 0.26: U201.5 28.11,53.58 27.78,53.91 SYNC.1 | R201.1 SYNC.1 | SYNC.1 R202.2
TPS62111_SW1
  pour Bottom (no thermals): 30,50 30,48 29,48 29,50
U
  Bottom 0.26: U300.3 46.76,56 47.14,55.62 47.14,54.12 45.06,52.04 45.06,42.63 J302.1
UART_RX
  Bottom 0.26: U$1.13 47.04,76.85 48.86,78.67 48.86,82 38.86,92 R104.2
UART_RX1
  Bottom 0.26: R104.1 22.65,92 17.13,97.52 J1.P$3
UART_TX
  Bottom 0.26: U$1.12 46.42,76.78 48.48,78.84 48.48,81.83 39.06,91.25 20.91,91.25 14.64,97.52 J1.P$2
V
  Bottom 0.26: U300.8 44.21,54.34 44.05,54.18 44.05,53.77 44.63,53.18 44.63,44.49 43.83,43.69 J302.3
VBUSP  (via drill 0.26, 0.35)  (43 unrouted)
  Bottom 0.26: J3.P$13 5.87,70.8 v5.87,70.55 5.87,70.3 J3.P$12 | J3.P$19 5.12,70.3 v5.12,70.55 5.12,70.8 J3.P$18 | J3.P$4 5.87,66.3 v5.87,66.05 5.87,65.8 J3.P$3 | J3.P$27 5.12,66.3 v5.12,66.05 5.12,65.8 J3.P$28 | LED1.A 15.08,44.01 v12.97,44.01 | U400.6 C401.1 | U201.8 30.48,54.66 C202.1 R201.2 v28.41,54.69
  other vias: 42.13,53.93 42.53,53.51 42.11,53.11 41.71,53.53 45.93,54.15 45.66,53.62 45.35,54.15 14.71,73.47 13.66,73.47 12.53,73.47 11.39,73.47 6.62,70.55 4.37,70.55 6.62,66.05 4.37,66.05 26.71,54.12 26.71,53.61 26.71,53.09
  pour Bottom: 41.11,56.99 40.59,56.99 40.46,56.86 40.46,53.14 40.61,52.99 41.56,52.99 41.77,52.78 42.19,52.78 42.74,53.33 42.74,53.79 42.21,54.32 41.65,54.32 41.28,54.69 41.28,56.82
  pour Bottom: 45.28,55.09 45.28,54.51 45.48,54.31 46.06,54.31 46.16,54.21 46.16,53.73 45.8,53.37 45.53,53.37 45.13,53.77 45.13,55.09
  pour Bottom: 14.91,74.58 11.19,74.58 11.13,74.52 11.13,73.14 11.26,73.01 14.73,73.01 14.95,73.23 14.95,74.54
  pour Bottom: 7.84,70.82 3.09,70.82 3.09,70.28 7.84,70.28
  pour Bottom: 7.84,66.32 3.09,66.32 3.09,65.78 7.84,65.78
  pour Bottom (no thermals): 28,51 24.61,51 24.61,54.52 28,54.52 28,54
  pour Route2: 0,42 14,42 24,52 30,52 31.46,53.46 33.54,53.46 35,52 46,52 48,54 48,60 42,66 23,66 20,69 20,92 21,93 21,103 6,103 arc90 0,97
W
  Bottom 0.26: U300.10 43.12,56 42.77,55.65 42.77,54.52 43.35,53.94 43.35,46.46 J302.5

### Text on the board
bPlace: ACS TestBench / Rev 4.3_flat / OreSat / Eric Ruhl
bNames: DEBUG_1 | DEBUG_2 | ADDR_0 | ADDR_1 | VBUSP | 3.3V